# EAGLE design homeboard13 (EAGLE 6.0)
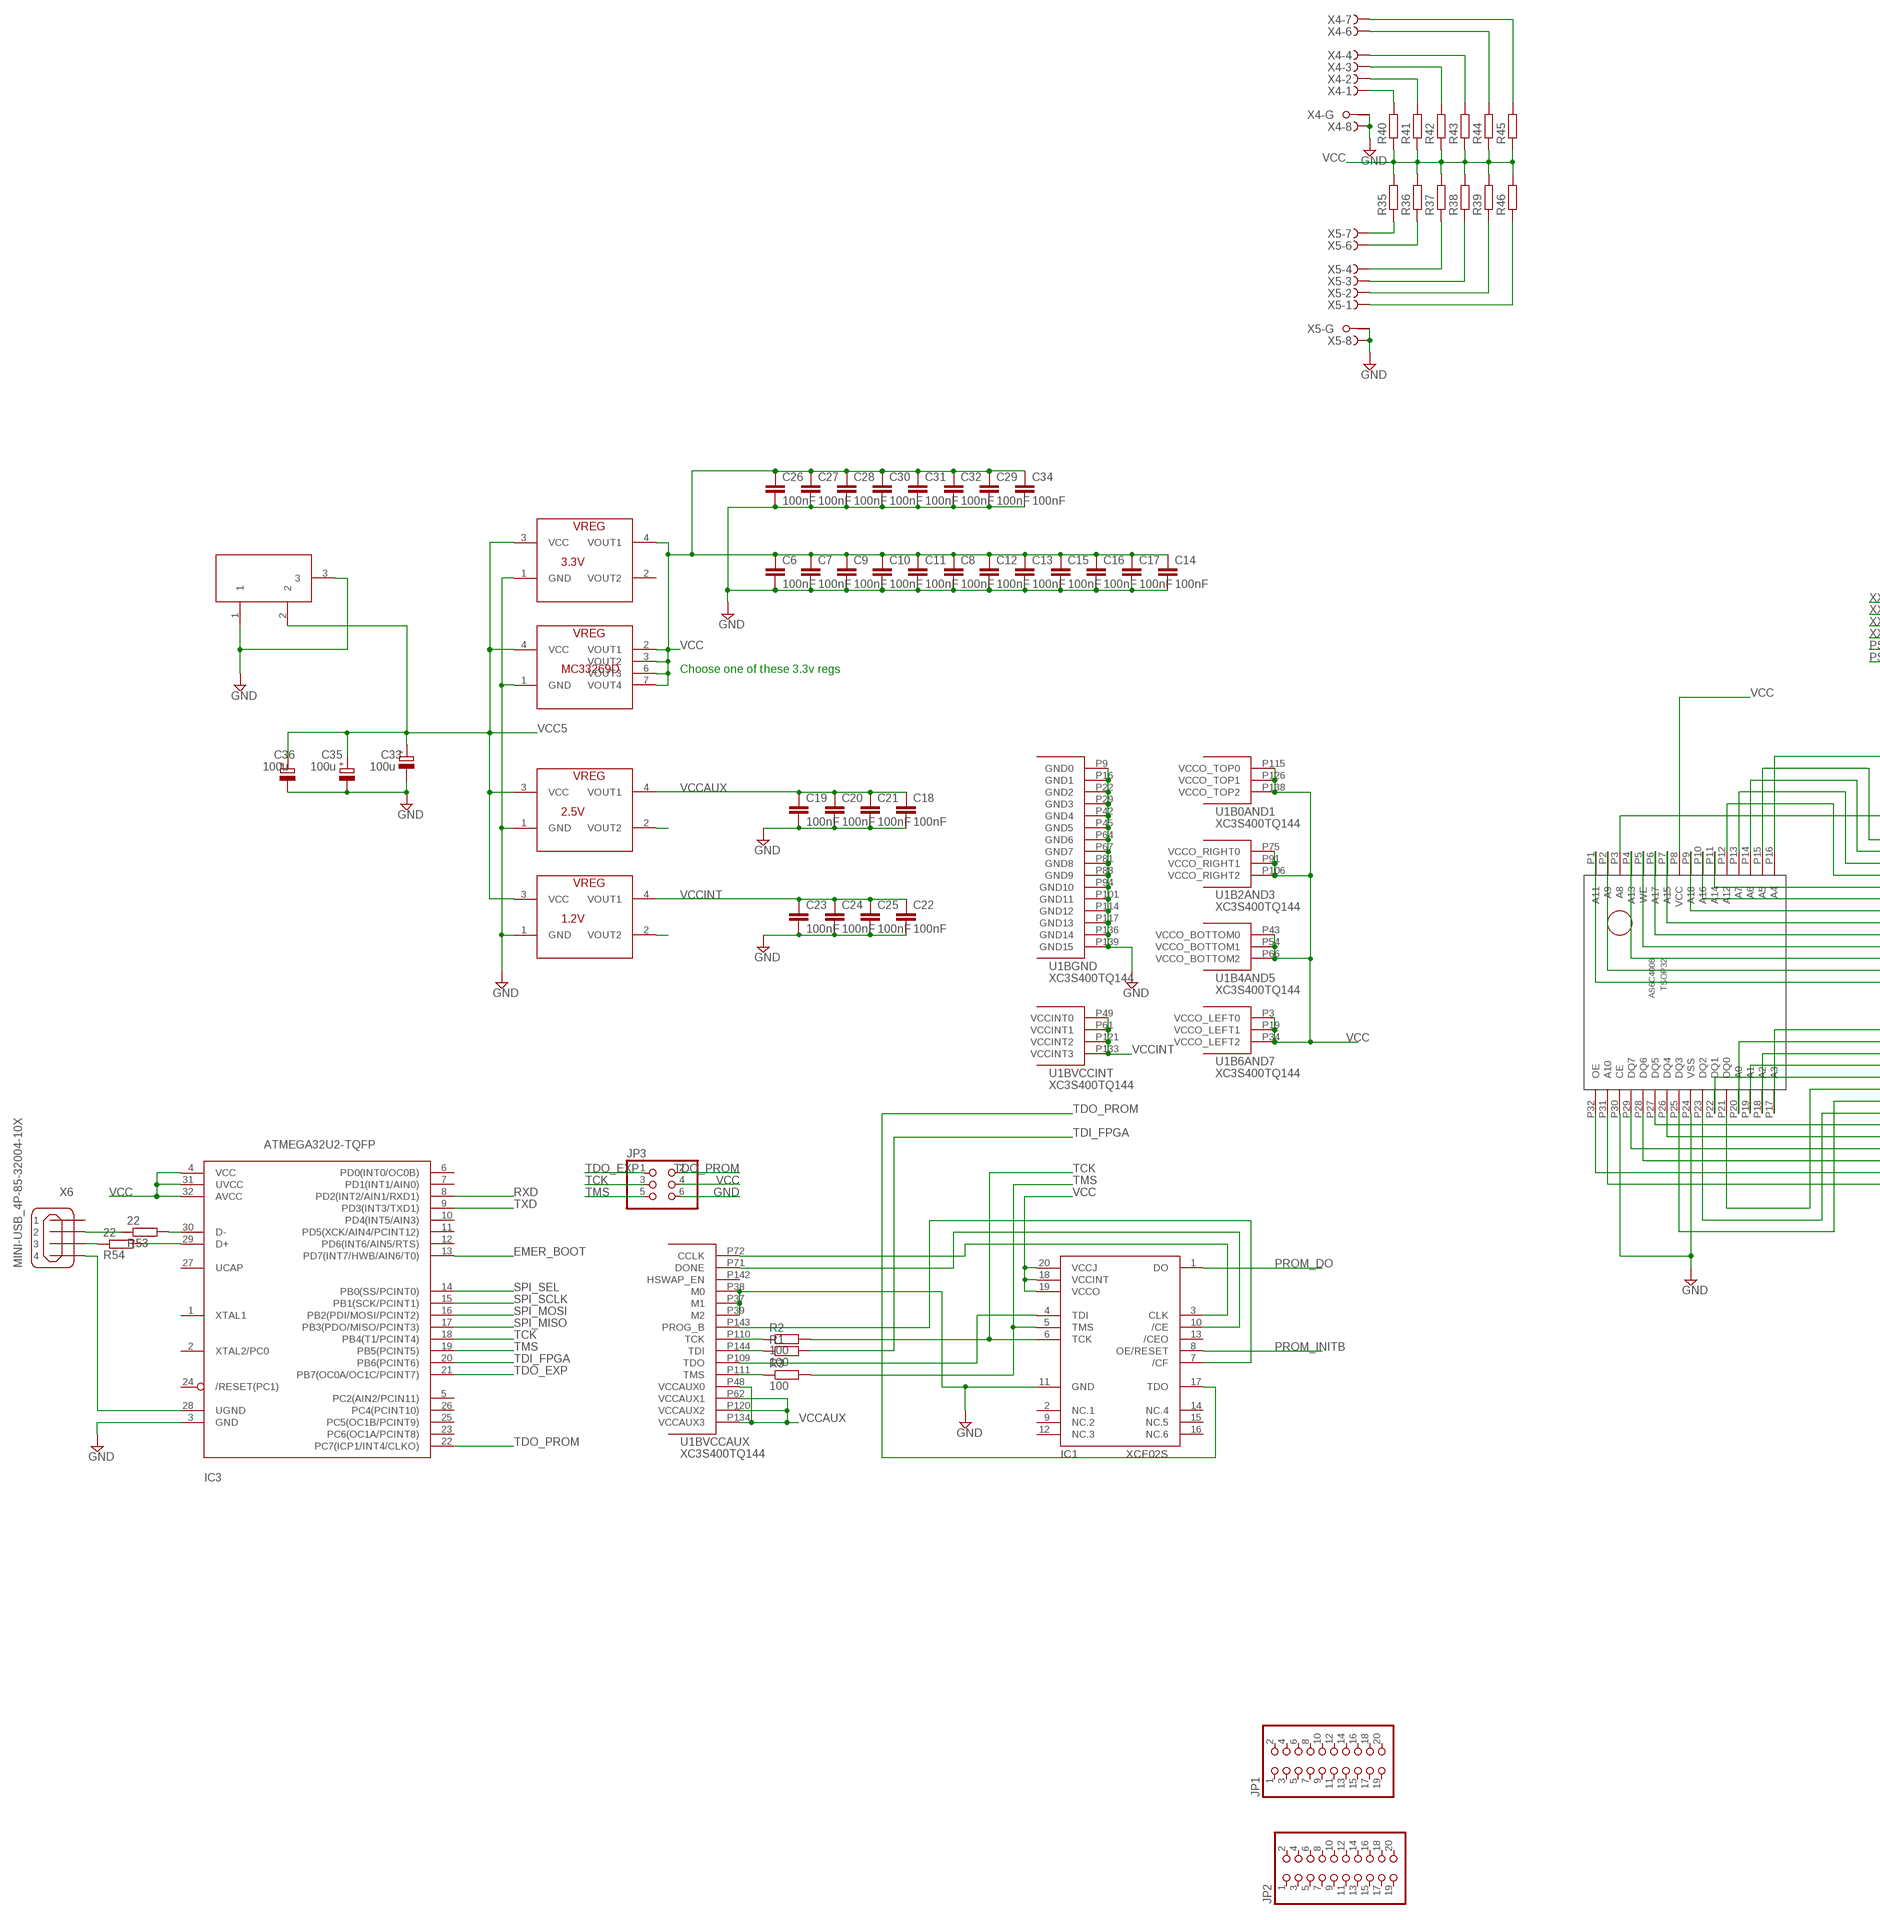
[diagram p0: schematic, sheet 1, part 1 of 3]
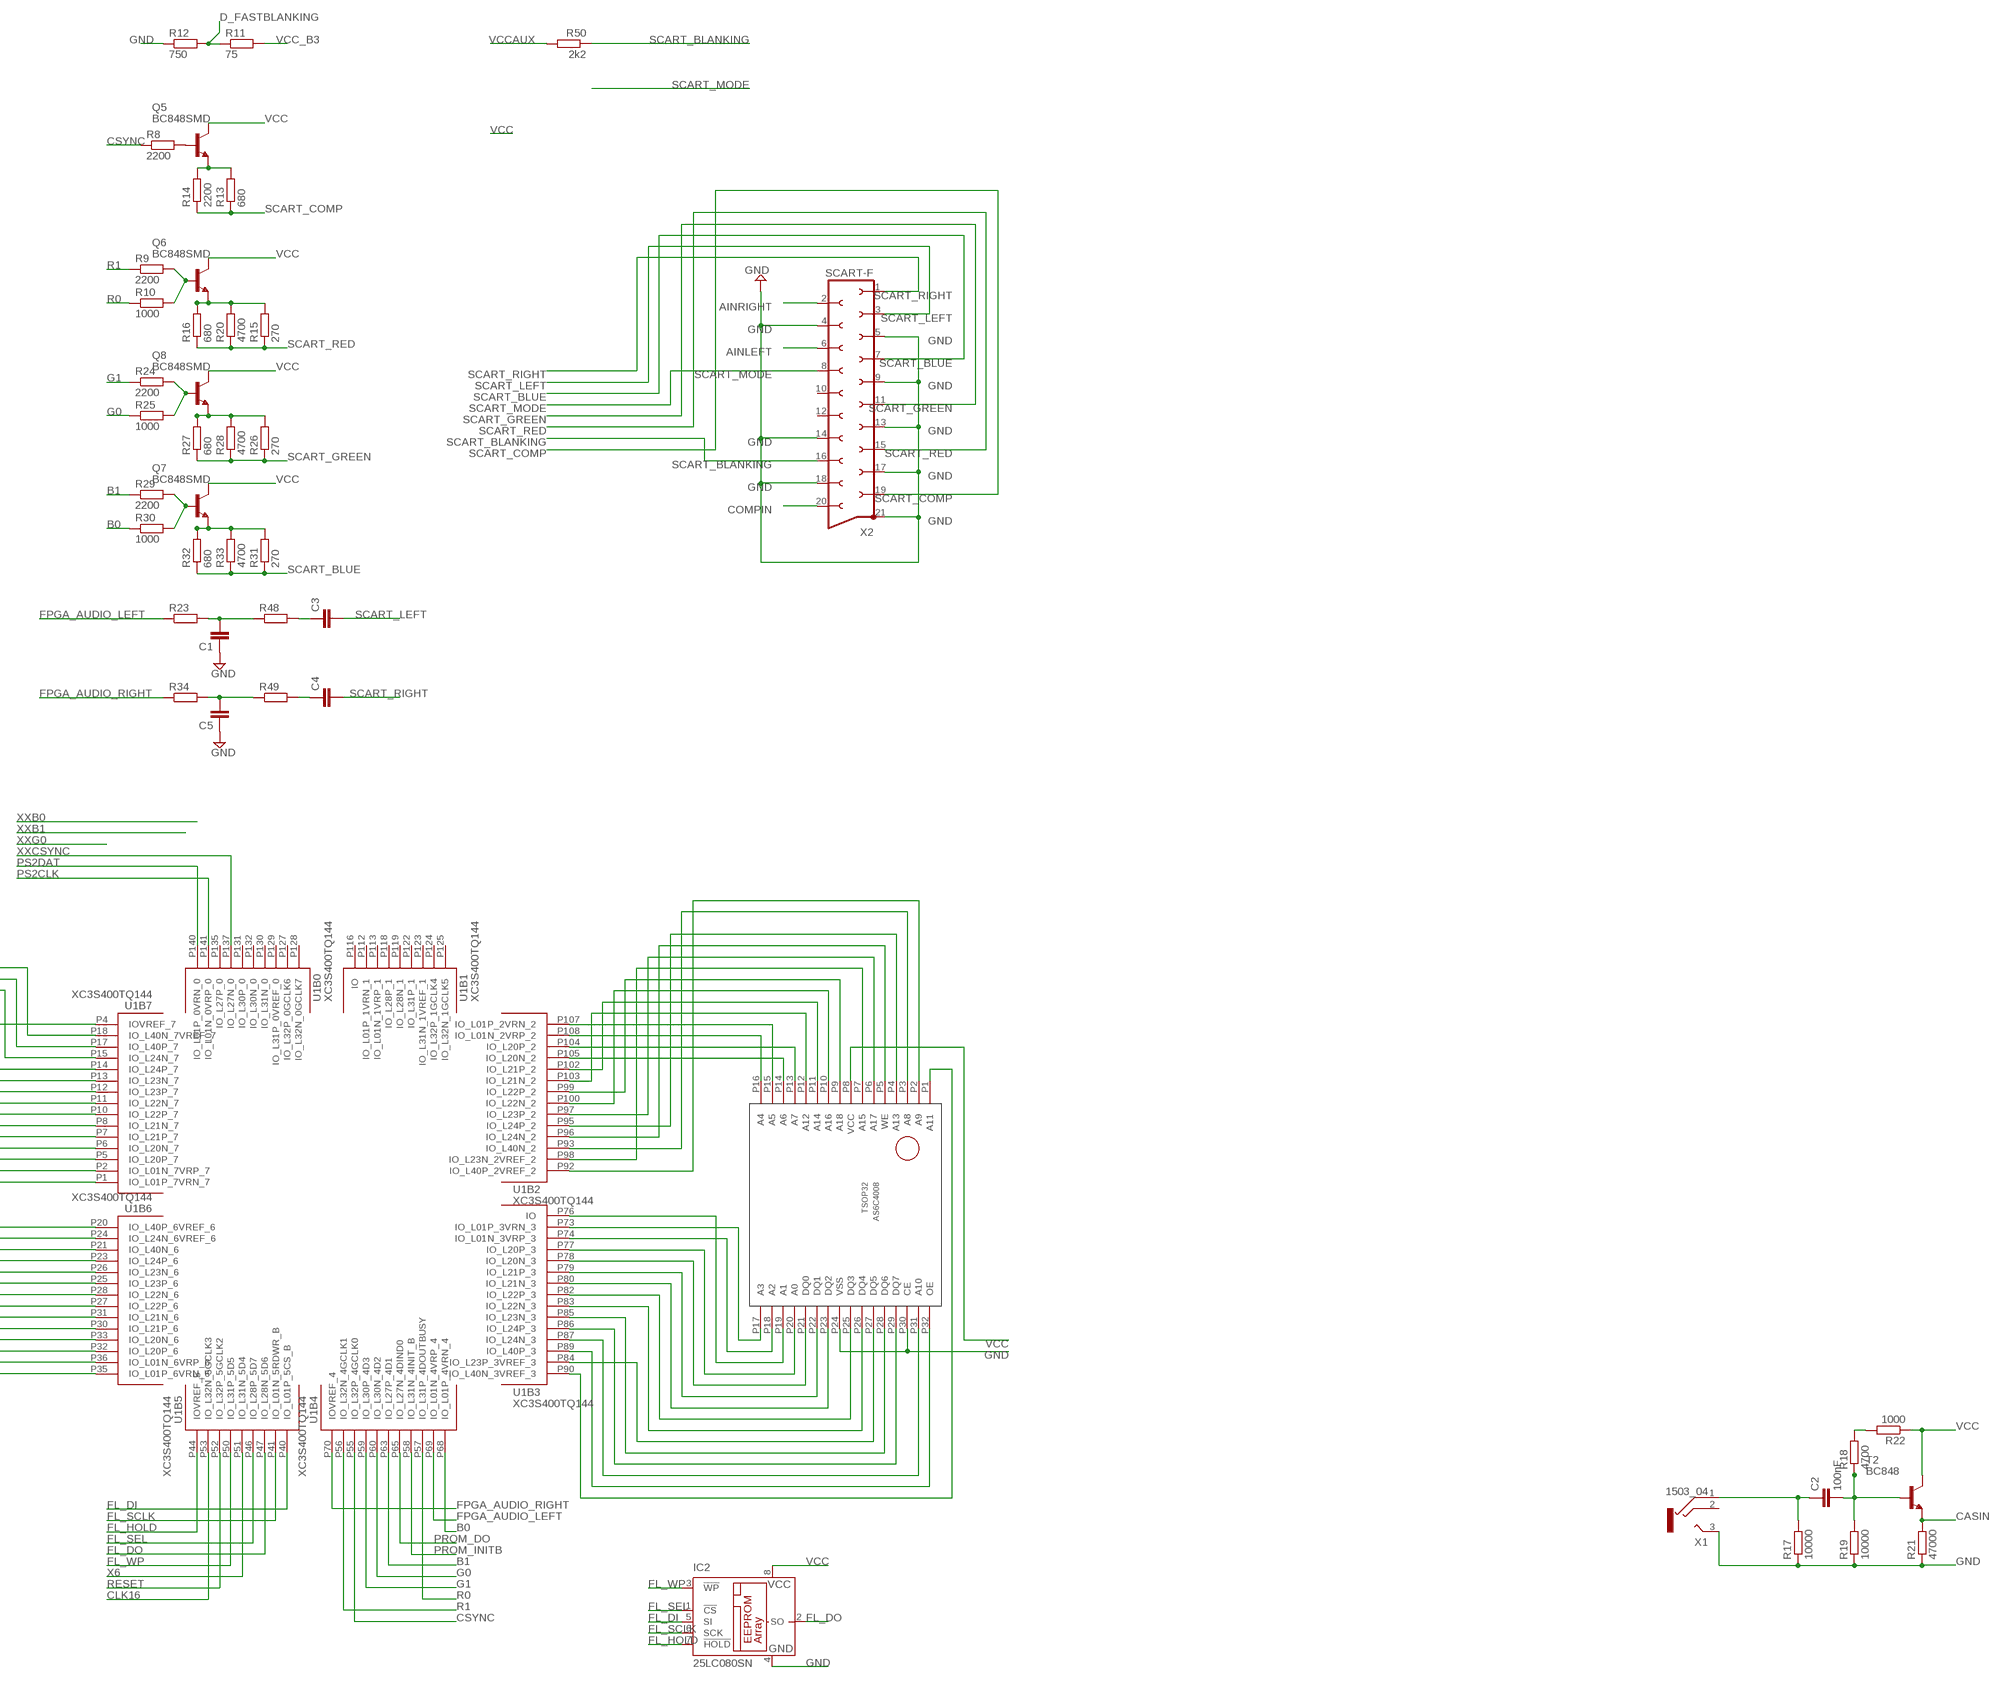
[diagram p1: schematic, sheet 1, part 2 of 3]
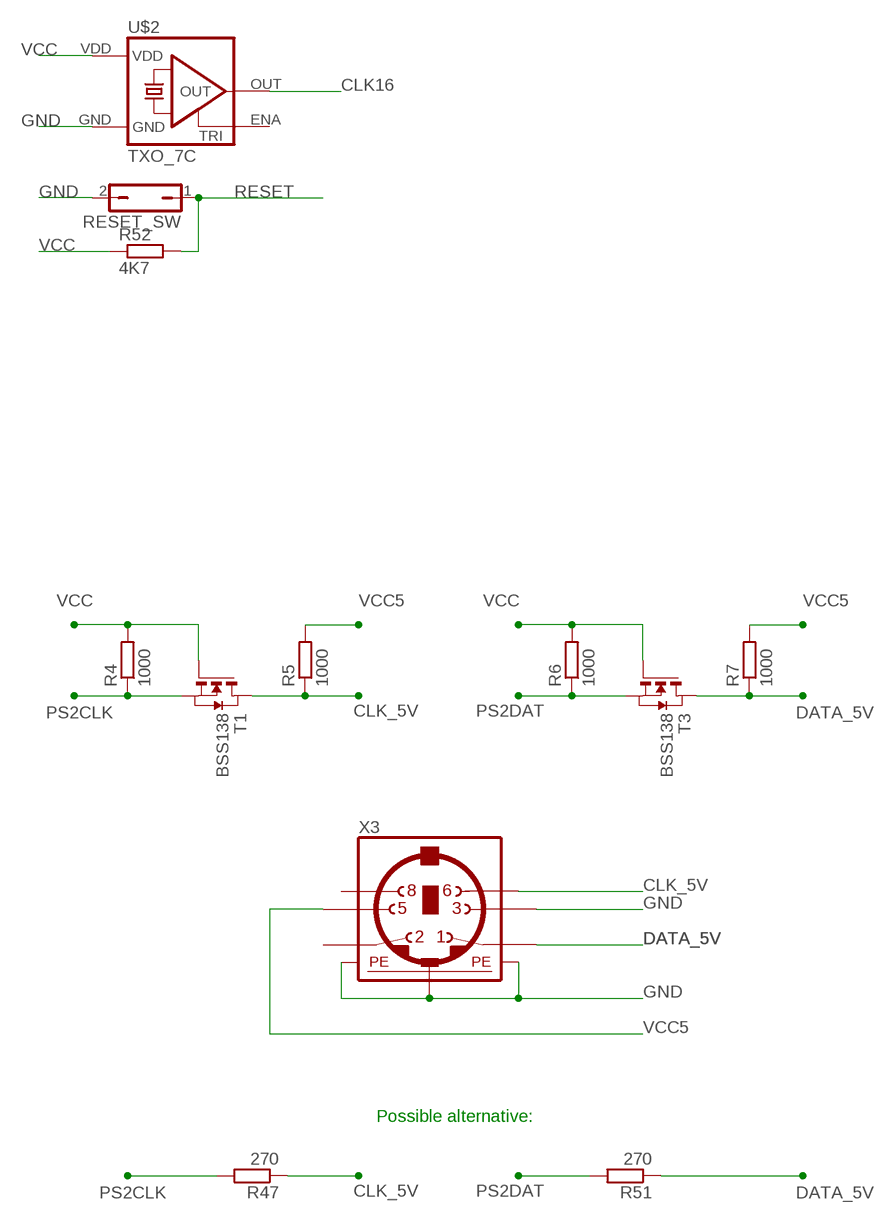
[diagram p2: schematic, sheet 1, part 3 of 3]

## Parts
C1  C-EUC0603  [C0603]
C2  100nF  C-EUC0603  [C0603]
C3  C-EUC0603  [C0603]
C4  C-EUC0603  [C0603]
C5  C-EUC0603  [C0603]
C6  100nF  C-EUC0603  [C0603]
C7  100nF  C-EUC0603  [C0603]
C8  100nF  C-EUC0603  [C0603]
C9  100nF  C-EUC0603  [C0603]
C10  100nF  C-EUC0603  [C0603]
C11  100nF  C-EUC0603  [C0603]
C12  100nF  C-EUC0603  [C0603]
C13  100nF  C-EUC0603  [C0603]
C14  100nF  C-EUC0603  [C0603]
C15  100nF  C-EUC0603  [C0603]
C16  100nF  C-EUC0603  [C0603]
C17  100nF  C-EUC0603  [C0603]
C18  100nF  C-EUC0603  [C0603]
C19  100nF  C-EUC0603  [C0603]
C20  100nF  C-EUC0603  [C0603]
C21  100nF  C-EUC0603  [C0603]
C22  100nF  C-EUC0603  [C0603]
C23  100nF  C-EUC0603  [C0603]
C24  100nF  C-EUC0603  [C0603]
C25  100nF  C-EUC0603  [C0603]
C26  100nF  C-EUC0603  [C0603]
C27  100nF  C-EUC0603  [C0603]
C28  100nF  C-EUC0603  [C0603]
C29  100nF  C-EUC0603  [C0603]
C30  100nF  C-EUC0603  [C0603]
C31  100nF  C-EUC0603  [C0603]
C32  100nF  C-EUC0603  [C0603]
C33  100u  CPOL-EUD  [PANASONIC_D]
C34  100nF  C-EUC0603  [C0603]
C35  100u  CPOL-EUD  [PANASONIC_D]
C36  100u  CPOL-EUD  [PANASONIC_D]
IC1  XCF02S  [VO20]
IC2  25LC080SN  [SO-08]
IC3  ATMEGA32U2-TQFP  [TQFP32-08]
JP1  PINHD-2X10  [2X10]
JP2  PINHD-2X10  [2X10]
JP3  PINHD-2X3  [2X03]
Q5  BC848SMD  [SOT23]
Q6  BC848SMD  [SOT23]
Q7  BC848SMD  [SOT23]
Q8  BC848SMD  [SOT23]
R1  100  R-EU_R0805  [R0805]
R2  100  R-EU_R0805  [R0805]
R3  100  R-EU_R0805  [R0805]
R4  1000  R-EU_R0805  [R0805]
R5  1000  R-EU_R0805  [R0805]
R6  1000  R-EU_R0805  [R0805]
R7  1000  R-EU_R0805  [R0805]
R8  2200  R-EU_R0805  [R0805]
R9  2200  R-EU_R0805  [R0805]
R10  1000  R-EU_R0805  [R0805]
R11  75  R-EU_R0805  [R0805]
R12  750  R-EU_R0805  [R0805]
R13  680  R-EU_R0805  [R0805]
R14  2200  R-EU_R0805  [R0805]
R15  270  R-EU_R0805  [R0805]
R16  680  R-EU_R0805  [R0805]
R17  10000  R-EU_R0805  [R0805]
R18  4700  R-EU_R0805  [R0805]
R19  10000  R-EU_R0805  [R0805]
R20  4700  R-EU_R0805  [R0805]
R21  47000  R-EU_R0805  [R0805]
R22  1000  R-EU_R0805  [R0805]
R23  R-EU_M0805  [M0805]
R24  2200  R-EU_R0805  [R0805]
R25  1000  R-EU_R0805  [R0805]
R26  270  R-EU_R0805  [R0805]
R27  680  R-EU_R0805  [R0805]
R28  4700  R-EU_R0805  [R0805]
R29  2200  R-EU_R0805  [R0805]
R30  1000  R-EU_R0805  [R0805]
R31  270  R-EU_R0805  [R0805]
R32  680  R-EU_R0805  [R0805]
R33  4700  R-EU_R0805  [R0805]
R34  R-EU_M0805  [M0805]
R35  R-EU_M0805  [M0805]
R36  R-EU_M0805  [M0805]
R37  R-EU_M0805  [M0805]
R38  R-EU_M0805  [M0805]
R39  R-EU_M0805  [M0805]
R40  R-EU_M0805  [M0805]
R41  R-EU_M0805  [M0805]
R42  R-EU_M0805  [M0805]
R43  R-EU_M0805  [M0805]
R44  R-EU_M0805  [M0805]
R45  R-EU_M0805  [M0805]
R46  R-EU_M0805  [M0805]
R47  270  R-EU_R0805  [R0805]
R48  R-EU_M0805  [M0805]
R49  R-EU_M0805  [M0805]
R50  2k2  R-EU_M0805  [M0805]
R51  270  R-EU_R0805  [R0805]
R52  4K7  R-EU_M0805  [M0805]
R53  22  R-EU_R0805  [R0805]
R54  22  R-EU_R0805  [R0805]
REG1.2  1.2V  NX1117  [SOT223]
REG2.5  2.5V  NX1117  [SOT223]
RESET_SW  JP1Q  [JP1]
T1  BSS138  NMOSSOT23  [SOT-23]
T2  BC848  [SOT23]
T3  BSS138  NMOSSOT23  [SOT-23]
U1  XC3S400TQ144  [TQ144]
U$1  AS6C4008  [TSOP32]
U$2  TXO_7C  [OSC_7C]
U$4  3.3V  NX1117  [SOT223]
U$5  MC33269D  [SO8]
U$6  AS6C4008  [TSOP32]
X1  1503_04  [1503_04]
X2  SCART-F  [SCART-F]
X3  MINI_DIN_6  [M_DIN6]
X4  F09HPS  [F09HP]
X5  F09HPS  [F09HP]
X6  MINI-USB_4P-85-32004-10X  [85-32004-10X]
X8  DC21MMX  [DC-21MM]

## Nets
AINLEFT: X2.6
AINRIGHT: X2.2
B0: R30.1 U1.P68(B4:IO_L01P_4VRN_4)
B1: R29.1 U1.P63(B4:IO_L27P_4D1)
CASIN: R21.2 T2.2(E)
CLK16: U1.P53(B5:IO_L32N_5GCLK3) U$2.OUT
CLK_5V: R5.1 R47.1 T1.1(D) X3.6
COMPIN: X2.20
CSYNC: R8.1 U1.P55(B4:IO_L32P_4GCLK0)
D_FASTBLANKING: R11.1 R12.2
DATA_5V: R7.1 R51.1 T3.1(D) X3.1
EMER_BOOT: IC3.13(PD7(INT7/HWB/AIN6/T0))
FL_DI: IC2.5(SI) U1.P40(B5:IO_L01P_5CS_B)
FL_DO: IC2.2(SO) U1.P47(B5:IO_L28N_5D6)
FL_HOLD: IC2.7(!HOLD) U1.P44(B5:IOVREF_5)
FL_SCLK: IC2.6(SCK) U1.P41(B5:IO_L01N_5RDWR_B)
FL_SEL: IC2.1(!CS) U1.P46(B5:IO_L28P_5D7)
FL_WP: IC2.3(!WP) U1.P50(B5:IO_L31P_5D5)
FPGA_AUDIO_LEFT: R23.1 U1.P69(B4:IO_L01N_4VRP_4)
FPGA_AUDIO_RIGHT: R34.1 U1.P70(B4:IOVREF_4)
G0: R25.1 U1.P60(B4:IO_L30N_4D2)
G1: R24.1 U1.P59(B4:IO_L30P_4D3)
GND: C1.1 C5.1 C6.2 C7.2 C8.2 C9.2 C10.2 C11.2 C12.2 C13.2 C14.2 C15.2 C16.2 C17.2 C18.2 C19.2 C20.2 C21.2 C22.2 C23.2 C24.2 C25.2 C26.2 C27.2 C28.2 C29.2 C30.2 C31.2 C32.2 C33.- C34.2 C35.- C36.- IC1.11(GND) IC2.4(GND) IC3.3(GND) JP3.6 R12.1 R17.1 R19.1 R21.1 REG1.2.1(GND) REG2.5.1(GND) RESET_SW.2 U1.P9(BGND:GND0) U1.P16(BGND:GND1) U1.P22(BGND:GND2) U1.P29(BGND:GND3) U1.P37(BVCCAUX:M1) U1.P38(BVCCAUX:M0) U1.P39(BVCCAUX:M2) U1.P42(BGND:GND4) U1.P45(BGND:GND5) U1.P64(BGND:GND6) U1.P67(BGND:GND7) U1.P81(BGND:GND8) U1.P88(BGND:GND9) U1.P94(BGND:GND10) U1.P101(BGND:GND11) U1.P114(BGND:GND12) U1.P117(BGND:GND13) U1.P136(BGND:GND14) U1.P139(BGND:GND15) U$1.P24(VSS) U$1.P30(CE) U$2.GND U$4.1(GND) U$5.1(GND) U$6.P24(VSS) U$6.P30(CE) X1.3 X2.4 X2.5 X2.9 X2.13 X2.14 X2.17 X2.18 X2.21 X3.3 X3.SH1(PE1) X3.SH2(PE2) X3.SH3(PE3) X4.8(-8:F) X4.G1(-G:G1) X5.8(-8:F) X5.G1(-G:G1) X8.1 X8.3
N$1: U1.P108(B2:IO_L01N_2VRP_2) U$1.P16(A4)
N$2: U1.P107(B2:IO_L01P_2VRN_2) U$1.P15(A5)
N$3: U1.P105(B2:IO_L20N_2) U$1.P14(A6)
N$4: U1.P104(B2:IO_L20P_2) U$1.P13(A7)
N$5: U1.P103(B2:IO_L21N_2) U$1.P12(A12)
N$6: U1.P102(B2:IO_L21P_2) U$1.P11(A14)
N$7: U1.P100(B2:IO_L22N_2) U$1.P10(A16)
N$8: U1.P99(B2:IO_L22P_2) U$1.P9(A18)
N$9: U1.P98(B2:IO_L23N_2VREF_2) U$1.P7(A15)
N$10: U1.P97(B2:IO_L23P_2) U$1.P6(A17)
N$11: U1.P96(B2:IO_L24N_2) U$1.P5(WE)
N$12: U1.P95(B2:IO_L24P_2) U$1.P4(A13)
N$13: U1.P93(B2:IO_L40N_2) U$1.P3(A8)
N$14: U1.P92(B2:IO_L40P_2VREF_2) U$1.P2(A9)
N$15: U1.P90(B3:IO_L40N_3VREF_3) U$1.P1(A11)
N$16: U1.P73(B3:IO_L01P_3VRN_3) U$1.P17(A3)
N$17: U1.P74(B3:IO_L01N_3VRP_3) U$1.P18(A2)
N$18: U1.P76(B3:IO) U$1.P19(A1)
N$19: U1.P77(B3:IO_L20P_3) U$1.P20(A0)
N$20: U1.P78(B3:IO_L20N_3) U$1.P21(DQ0)
N$21: U1.P79(B3:IO_L21P_3) U$1.P22(DQ1)
N$22: U1.P80(B3:IO_L21N_3) U$1.P23(DQ2)
N$23: U1.P82(B3:IO_L22P_3) U$1.P25(DQ3)
N$24: U1.P83(B3:IO_L22N_3) U$1.P26(DQ4)
N$25: U1.P84(B3:IO_L23P_3VREF_3) U$1.P27(DQ5)
N$26: U1.P85(B3:IO_L23N_3) U$1.P28(DQ6)
N$27: U1.P86(B3:IO_L24P_3) U$1.P29(DQ7)
N$28: U1.P87(B3:IO_L24N_3) U$1.P31(A10)
N$29: U1.P89(B3:IO_L40P_3) U$1.P32(OE)
N$30: R35.1 X5.7(-7:F)
N$31: R36.1 X5.6(-6:F)
N$32: R37.1 X5.4(-4:F)
N$33: R38.1 X5.3(-3:F)
N$34: R39.1 X5.2(-2:F)
N$35: IC1.3(CLK) U1.P72(BVCCAUX:CCLK)
N$36: R53.1 X6.2
N$37: R46.1 X5.1(-1:F)
N$38: IC1.10(/CE) U1.P71(BVCCAUX:DONE)
N$39: R2.1 U1.P110(BVCCAUX:TCK)
N$40: IC1.7(/CF) U1.P143(BVCCAUX:PROG_B)
N$41: R40.2 X4.1(-1:F)
N$42: R1.1 U1.P144(BVCCAUX:TDI)
N$43: R3.1 U1.P111(BVCCAUX:TMS)
N$44: R41.2 X4.2(-2:F)
N$45: R42.2 X4.3(-3:F)
N$46: R43.2 X4.4(-4:F)
N$47: R44.2 X4.6(-6:F)
N$48: R45.2 X4.7(-7:F)
N$49: IC3.29(D+) R54.2
N$50: REG2.5.2(VOUT2)
N$51: C1.2 R23.2 R48.1
N$52: C3.1 R48.2
N$53: Q6.1(B) R9.2 R10.2
N$54: Q6.2(E) R15.2 R16.2 R20.2
N$55: Q8.1(B) R24.2 R25.2
N$56: Q8.2(E) R26.2 R27.2 R28.2
N$57: Q7.1(B) R29.2 R30.2
N$58: Q7.2(E) R31.2 R32.2 R33.2
N$59: Q5.2(E) R13.2 R14.2
N$60: C2.2 R18.1 R19.2 T2.1(B)
N$61: C2.1 R17.2 X1.1
N$62: R18.2 R22.2
N$63: Q5.1(B) R8.2
N$64: C4.1 R49.2
N$65: C5.2 R34.2 R49.1
N$66: R54.1 X6.3
N$67: U1.P1(B7:IO_L01P_7VRN_7) U$6.P1(A11)
N$68: IC3.30(D-) R53.2
N$69: IC3.28(UGND) X6.4
N$70: REG1.2.2(VOUT2)
N$71: U1.P2(B7:IO_L01N_7VRP_7) U$6.P2(A9)
N$72: U1.P4(B7:IOVREF_7) U$6.P3(A8)
N$73: U1.P5(B7:IO_L20P_7) U$6.P4(A13)
N$74: U1.P6(B7:IO_L20N_7) U$6.P5(WE)
N$75: U1.P7(B7:IO_L21P_7) U$6.P6(A17)
N$76: U1.P8(B7:IO_L21N_7) U$6.P7(A15)
N$77: U1.P10(B7:IO_L22P_7) U$6.P9(A18)
N$78: U1.P11(B7:IO_L22N_7) U$6.P10(A16)
N$79: U1.P12(B7:IO_L23P_7) U$6.P11(A14)
N$80: U1.P13(B7:IO_L23N_7) U$6.P12(A12)
N$81: U1.P14(B7:IO_L24P_7) U$6.P13(A7)
N$82: U1.P15(B7:IO_L24N_7) U$6.P14(A6)
N$83: U1.P17(B7:IO_L40P_7) U$6.P15(A5)
N$84: U1.P18(B7:IO_L40N_7VREF_7) U$6.P16(A4)
N$85: U1.P20(B6:IO_L40P_6VREF_6) U$6.P17(A3)
N$86: U1.P21(B6:IO_L40N_6) U$6.P18(A2)
N$87: U1.P23(B6:IO_L24P_6) U$6.P19(A1)
N$88: U1.P24(B6:IO_L24N_6VREF_6) U$6.P20(A0)
N$89: U1.P25(B6:IO_L23P_6) U$6.P21(DQ0)
N$90: U1.P26(B6:IO_L23N_6) U$6.P22(DQ1)
N$91: U1.P27(B6:IO_L22P_6) U$6.P23(DQ2)
N$92: U1.P28(B6:IO_L22N_6) U$6.P25(DQ3)
N$93: U1.P30(B6:IO_L21P_6) U$6.P26(DQ4)
N$94: U1.P31(B6:IO_L21N_6) U$6.P27(DQ5)
N$95: U1.P32(B6:IO_L20P_6) U$6.P28(DQ6)
N$96: U1.P33(B6:IO_L20N_6) U$6.P29(DQ7)
N$97: U1.P35(B6:IO_L01P_6VRN_6) U$6.P31(A10)
N$98: U1.P36(B6:IO_L01N_6VRP_6) U$6.P32(OE)
PROM_DO: IC1.1(DO) U1.P65(B4:IO_L27N_4DIND0)
PROM_INITB: IC1.8(OE/RESET) U1.P58(B4:IO_L31N_4INIT_B)
PS2CLK: R4.1 R47.2 T1.2(S) U1.P141(B0:IO_L01N_0VRP_0)
PS2DAT: R6.1 R51.2 T3.2(S) U1.P140(B0:IO_L01P_0VRN_0)
R0: R10.1 U1.P57(B4:IO_L31P_4DOUTBUSY)
R1: R9.1 U1.P56(B4:IO_L32N_4GCLK1)
RESET: R52.2 RESET_SW.1 U1.P52(B5:IO_L32P_5GCLK2)
RXD: IC3.8(PD2(INT2/AIN1/RXD1))
SCART_BLANKING: R50.1 X2.16
SCART_BLUE: R31.1 R32.1 R33.1 X2.7
SCART_COMP: R13.1 R14.1 X2.19
SCART_GREEN: R26.1 R27.1 R28.1 X2.11
SCART_LEFT: C3.2 X2.3
SCART_MODE: X2.8
SCART_RED: R15.1 R16.1 R20.1 X2.15
SCART_RIGHT: C4.2 X2.1
SPI_MISO: IC3.17(PB3(PDO/MISO/PCINT3))
SPI_MOSI: IC3.16(PB2(PDI/MOSI/PCINT2))
SPI_SCLK: IC3.15(PB1(SCK/PCINT1))
SPI_SEL: IC3.14(PB0(SS/PCINT0))
TCK: IC1.6(TCK) IC3.18(PB4(T1/PCINT4)) JP3.3 R2.2
TDI_FPGA: IC3.20(PB6(PCINT6)) R1.2
TDO_EXP: IC3.21(PB7(OC0A/OC1C/PCINT7)) JP3.1
TDO_FPGA: IC1.4(TDI) U1.P109(BVCCAUX:TDO)
TDO_PROM: IC1.17(TDO) IC3.22(PC7(ICP1/INT4/CLKO)) JP3.2
TMS: IC1.5(TMS) IC3.19(PB5(PCINT5)) JP3.5 R3.2
TXD: IC3.9(PD3(INT3/TXD1))
VCC: C6.1 C7.1 C8.1 C9.1 C10.1 C11.1 C12.1 C13.1 C14.1 C15.1 C16.1 C17.1 C26.1 C27.1 C28.1 C29.1 C30.1 C31.1 C32.1 C34.1 IC1.18(VCCINT) IC1.19(VCCO) IC1.20(VCCJ) IC2.8(VCC) IC3.4(VCC) IC3.31(UVCC) IC3.32(AVCC) JP3.4 Q5.3(C) Q6.3(C) Q7.3(C) Q8.3(C) R4.2 R6.2 R22.1 R35.2 R36.2 R37.2 R38.2 R39.2 R40.1 R41.1 R42.1 R43.1 R44.1 R45.1 R46.2 R52.1 T1.3(G) T2.3(C) T3.3(G) U1.P3(B6AND7:VCCO_LEFT0) U1.P19(B6AND7:VCCO_LEFT1) U1.P34(B6AND7:VCCO_LEFT2) U1.P43(B4AND5:VCCO_BOTTOM0) U1.P54(B4AND5:VCCO_BOTTOM1) U1.P66(B4AND5:VCCO_BOTTOM2) U1.P75(B2AND3:VCCO_RIGHT0) U1.P91(B2AND3:VCCO_RIGHT1) U1.P106(B2AND3:VCCO_RIGHT2) U1.P115(B0AND1:VCCO_TOP0) U1.P126(B0AND1:VCCO_TOP1) U1.P138(B0AND1:VCCO_TOP2) U$1.P8(VCC) U$2.VDD U$4.4(VOUT1) U$5.2(VOUT1) U$5.3(VOUT2) U$5.6(VOUT3) U$5.7(VOUT4) U$6.P8(VCC)
VCC5: C33.+ C35.+ C36.+ R5.2 R7.2 REG1.2.3(VCC) REG2.5.3(VCC) U$4.3(VCC) U$5.4(VCC) X3.5 X8.2
VCC_B3: R11.2
VCCAUX: C18.1 C19.1 C20.1 C21.1 R50.2 REG2.5.4(VOUT1) U1.P48(BVCCAUX:VCCAUX0) U1.P62(BVCCAUX:VCCAUX1) U1.P120(BVCCAUX:VCCAUX2) U1.P134(BVCCAUX:VCCAUX3)
VCCINT: C22.1 C23.1 C24.1 C25.1 REG1.2.4(VOUT1) U1.P49(BVCCINT:VCCINT0) U1.P61(BVCCINT:VCCINT1) U1.P121(BVCCINT:VCCINT2) U1.P133(BVCCINT:VCCINT3)
X6: U1.P51(B5:IO_L31N_5D4)
XXCSYNC: U1.P137(B0:IO_L27N_0)
Unconnected: IC1.2(NC.1) IC1.9(NC.2) IC1.12(NC.3) IC1.13(/CEO) IC1.14(NC.4) IC1.15(NC.5) IC1.16(NC.6) IC3.1(XTAL1) IC3.2(XTAL2/PC0) IC3.5(PC2(AIN2/PCIN11)) IC3.6(PD0(INT0/OC0B)) IC3.7(PD1(INT1/AIN0)) IC3.10(PD4(INT5/AIN3)) IC3.11(PD5(XCK/AIN4/PCINT12)) IC3.12(PD6(INT6/AIN5/RTS)) IC3.23(PC6(OC1A/PCINT8)) IC3.24(/RESET(PC1)) IC3.25(PC5(OC1B/PCINT9)) IC3.26(PC4(PCINT10)) IC3.27(UCAP) JP1.1 JP1.2 JP1.3 JP1.4 JP1.5 JP1.6 JP1.7 JP1.8 JP1.9 JP1.10 JP1.11 JP1.12 JP1.13 JP1.14 JP1.15 JP1.16 JP1.17 JP1.18 JP1.19 JP1.20 JP2.1 JP2.2 JP2.3 JP2.4 JP2.5 JP2.6 JP2.7 JP2.8 JP2.9 JP2.10 JP2.11 JP2.12 JP2.13 JP2.14 JP2.15 JP2.16 JP2.17 JP2.18 JP2.19 JP2.20 U1.P112(B1:IO_L01P_1VRN_1) U1.P113(B1:IO_L01N_1VRP_1) U1.P116(B1:IO) U1.P118(B1:IO_L28P_1) U1.P119(B1:IO_L28N_1) U1.P122(B1:IO_L31P_1) U1.P123(B1:IO_L31N_1VREF_1) U1.P124(B1:IO_L32P_1GCLK4) U1.P125(B1:IO_L32N_1GCLK5) U1.P127(B0:IO_L32P_0GCLK6) U1.P128(B0:IO_L32N_0GCLK7) U1.P129(B0:IO_L31P_0VREF_0) U1.P130(B0:IO_L31N_0) U1.P131(B0:IO_L30P_0) U1.P132(B0:IO_L30N_0) U1.P135(B0:IO_L27P_0) U1.P142(BVCCAUX:HSWAP_EN) U$2.ENA(TRI) U$4.2(VOUT2) X1.2 X2.10 X2.12 X3.2 X3.8 X4.5(-5:F) X4.9(-9:F) X4.G2(-G:G2) X5.5(-5:F) X5.9(-9:F) X5.G2(-G:G2) X6.1

## Notes on the sheet
- Choose one of these 3.3v regs
- Possible alternative:

## Library data of the parts
C1-C5 = resistor:C-EU: CAPACITOR, European symbol
C6-C32 C34 = rcl:C-EU: CAPACITOR, European symbol
C33 C35 C36 = rcl:CPOL-EU: POLARIZED CAPACITOR, European symbol
IC1 = smd-special:XCF02S
IC2 = microchip:25*: Serial EEPROM 4K/ 8K , SPI bus; MF: MICROCHIP; MPN: 25LC080/SN; OC_FARNELL: 1137302; OC_NEWARK: 96K4092
IC3 = adafruit:ATMEGA32U2: ATmega32u2 Pin compatible with the atmega8u2, atmega16u2 and atmega32u2 8, 16 or 32 K flash, 1K RAM, 512b EEPROM 8 bit and 16 bit timer (5 PWM total) UART, SPI (no I2C!) USB with 4 endpoints, LUFA compatible 22 I/O lines, analog comparator (no ADC!) Comes with DFU bootloader burned in!
JP1 JP2 = pinhead:PINHD-2X10: PIN HEADER
JP3 = pinhead:PINHD-2X3: PIN HEADER
Q5-Q8 = bc548:BC848*: NPN Transistor
R1-R22 R24-R33 R47 R51 R53 R54 = rcl:R-EU_: RESISTOR, European symbol
R23 R34-R46 R48-R50 R52 = resistor:R-EU_: RESISTOR, European symbol
REG1.2 REG2.5 U$4 = cpcfpga:NX1117
RESET_SW = jumper:JP1Q: JUMPER
T1 T3 = zetex:NMOSSOT23: MOS FET; OC_FARNELL: unknown; OC_NEWARK: unknown
T2 = transistor:BC848: NPN TRANSISTOR
U1 = xilinx_spartan3_virtex4_and_5:XC3S400TQ144: Xilinx FPGA
U$1 U$6 = cpcfpga:AS6C4008
U$2 = cpcfpga:TXO_7C: TXC crystal oscillator http://www.txccrystal.com/images/pdf/7c.pdf
U$5 = cpcfpga:MC33269D
X1 = con-lumberg:1503_04: Jack connectors according to JISC 6560, 3.5 mm, IP 57 Klinkensteckverbinder nach JISC 6560, 3,5 mm, IP 57 Source: http://www.lumberg.com/Produkte/PDFs/1503_04.pdf; OC_FARNELL: 1216981; OC_NEWARK: unknown
X2 = con-hirschmann:SCART-F: TV SCART CONNECTOR; OC_FARNELL: unknown; OC_NEWARK: unknown
X3 = mini_din:MINI_DIN_6
X4 X5 = con-subd:F09HPS: SUB-D; OC_FARNELL: unknown; OC_NEWARK: unknown
X6 = con-cypressindustries:MINI-USB_4P-: MINI USB 4 Pol. Source: www.cypressindustries.com; OC_FARNELL: unknown; OC_NEWARK: unknown
X8 = powersupply:DC21MM

## Net classes
1 power: width 0.6 mm, drill 1.1 mm, clearance 0.4 mm
2 gnd: width 0.305 mm, drill 0.508 mm, clearance 0.152 mm

## Board
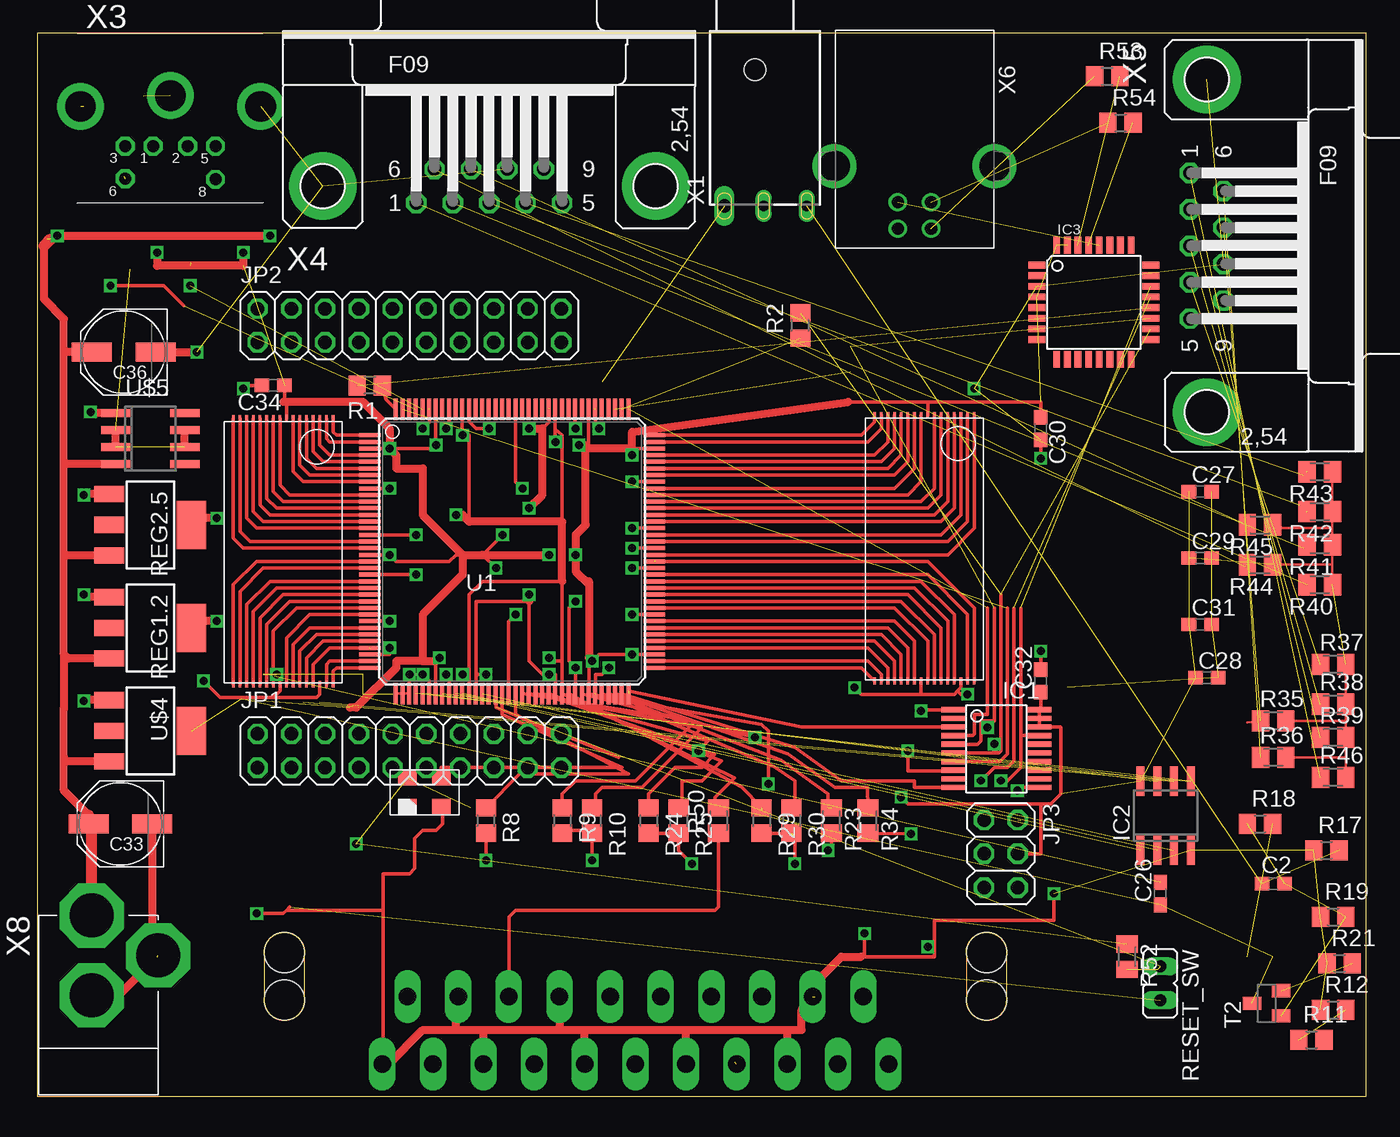
[diagram p3: board, top side]
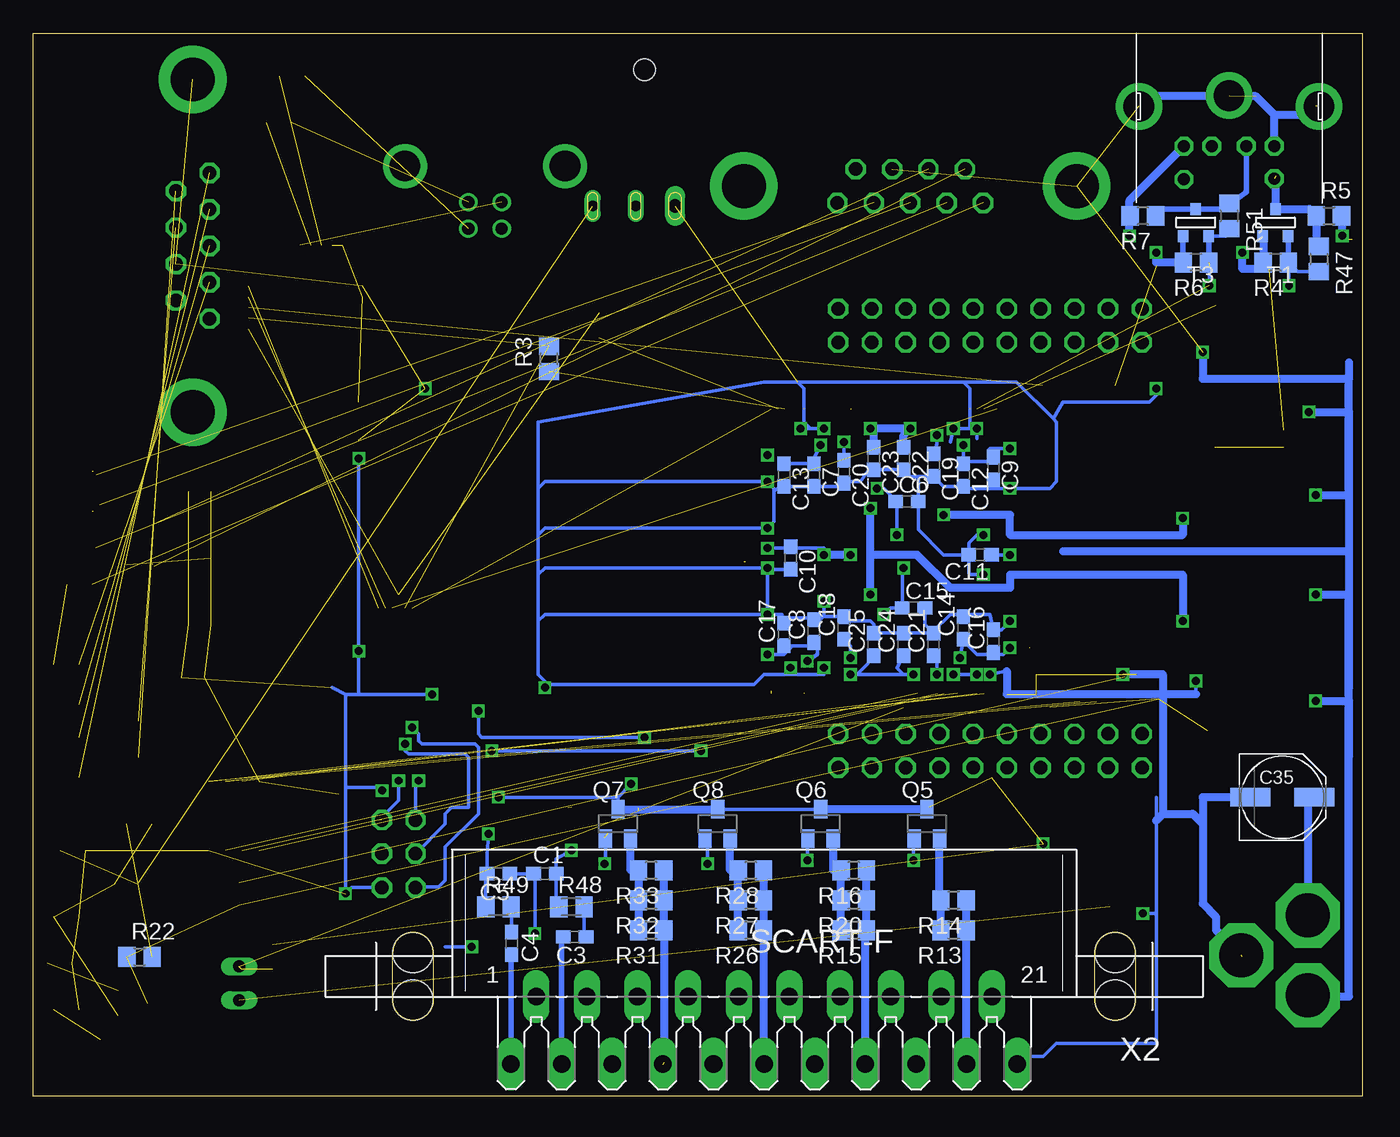
[diagram p4: board, bottom side, seen from below]

Size 100 x 80 mm. Coordinates in mm from the lower left corner, seen from the top.
Outline: 0,0 100,0 100,80 0,80 0,0
Copper layers (1*16): Top 0.0356mm / dielectric 1.5011mm / Bottom 0.0356mm
Design rules: minimum track width 6mil, minimum drill 13mil, track to track 6mil, track to pad 6mil, pad to pad 6mil, via to via 6mil, smd to smd 6mil, copper to edge 15mil, drill to drill 6mil, minimum pad ring 7mil, minimum via ring 7mil, stop-mask expansion 4mil, vias tented up to drill 0mil, thermal gap 10mil

### Footprints (pad centres in the part's own frame; a part is rotated, then mirrored left to right if it is on the bottom)
C0603 = smd 1.1 x 1: 1 -0.85,0; 2 0.85,0
PANASONIC_D = smd 3 x 1.4: + 2.4,0; - -2.4,0
VO20 = smd 0.4 x 1.8: 1 5.85,6.15; 2 5.2,6.15; 3 4.55,6.15; 4 3.9,6.15; 5 3.25,6.15; 6 2.6,6.15; 7 1.95,6.15; 8 1.3,6.15; 9 0.65,6.15; 10 0,6.15; 11 0,-0.3; 12 0.65,-0.3; 13 1.3,-0.3; 14 1.95,-0.3; 15 2.6,-0.3; 16 3.25,-0.3; 17 3.9,-0.3; 18 4.55,-0.3; 19 5.2,-0.3; 20 5.85,-0.3
SO-08 = smd 0.6 x 2.2: 1 -1.905,-2.6; 2 -0.635,-2.6; 3 0.635,-2.6; 4 1.905,-2.6; 5 1.905,2.6; 6 0.635,2.6; 7 -0.635,2.6; 8 -1.905,2.6
TQFP32-08 = smd 1.27 x 0.508: 1 -4.293,2.8; 2 -4.293,2; 3 -4.293,1.2; 4 -4.293,0.4; 5 -4.293,-0.4; 6 -4.293,-1.2; 7 -4.293,-2; 8 -4.293,-2.8; 17 4.293,-2.8; 18 4.293,-2; 19 4.293,-1.2; 20 4.293,-0.4; 21 4.293,0.4; 22 4.293,1.2; 23 4.293,2; 24 4.293,2.8 | smd 0.508 x 1.27: 9 -2.8,-4.293; 10 -2,-4.293; 11 -1.2,-4.293; 12 -0.4,-4.293; 13 0.4,-4.293; 14 1.2,-4.293; 15 2,-4.293; 16 2.8,-4.293; 25 2.8,4.293; 26 2,4.293; 27 1.2,4.293; 28 0.4,4.293; 29 -0.4,4.293; 30 -1.2,4.293; 31 -2,4.293; 32 -2.8,4.293
2X10 = drill 1.016 octagon: 1 -11.43,-1.27; 2 -11.43,1.27; 3 -8.89,-1.27; 4 -8.89,1.27; 5 -6.35,-1.27; 6 -6.35,1.27; 7 -3.81,-1.27; 8 -3.81,1.27; 9 -1.27,-1.27; 10 -1.27,1.27; 11 1.27,-1.27; 12 1.27,1.27; 13 3.81,-1.27; 14 3.81,1.27; 15 6.35,-1.27; 16 6.35,1.27; 17 8.89,-1.27; 18 8.89,1.27; 19 11.43,-1.27; 20 11.43,1.27
2X03 = drill 1.016 octagon: 1 -2.54,-1.27; 2 -2.54,1.27; 3 0,-1.27; 4 0,1.27; 5 2.54,-1.27; 6 2.54,1.27
SOT23 = smd 1 x 1.4: 1 -0.95,-1.1; 2 0.95,-1.1; 3 0,1.1
R0805 = smd 1.3 x 1.5: 1 -0.95,0; 2 0.95,0
M0805 = smd 1.3 x 1.6: 1 -0.95,0; 2 0.95,0
SOT223 = smd 1.219 x 2.235: 1 -2.311,-3.099; 2 0,-3.099; 3 2.311,-3.099 | smd 3.6 x 2.2: 4 0,3.099
JP1 = drill 0.914 long: 1 0,-1.27; 2 0,1.27
SOT-23 = smd 0.787 x 0.889: 1 0.025,-1.016; 2 -0.94,1.016; 3 0.991,1.016
TQ144 = smd 1.6 x 0.3: P1 -10.7,8.75; P2 -10.7,8.25; P3 -10.7,7.75; P4 -10.7,7.25; P5 -10.7,6.75; P6 -10.7,6.25; P7 -10.7,5.75; P8 -10.7,5.25; P9 -10.7,4.75; P10 -10.7,4.25; P11 -10.7,3.75; P12 -10.7,3.25; P13 -10.7,2.75; P14 -10.7,2.25; P15 -10.7,1.75; P16 -10.7,1.25; P17 -10.7,0.75; P18 -10.7,0.25; P19 -10.7,-0.25; P20 -10.7,-0.75; P21 -10.7,-1.25; P22 -10.7,-1.75; P23 -10.7,-2.25; P24 -10.7,-2.75; P25 -10.7,-3.25; P26 -10.7,-3.75; P27 -10.7,-4.25; P28 -10.7,-4.75; P29 -10.7,-5.25; P30 -10.7,-5.75; P31 -10.7,-6.25; P32 -10.7,-6.75; P33 -10.7,-7.25; P34 -10.7,-7.75; P35 -10.7,-8.25; P36 -10.7,-8.75; P73 10.7,-8.75; P74 10.7,-8.25; P75 10.7,-7.75; P76 10.7,-7.25; P77 10.7,-6.75; P78 10.7,-6.25; P79 10.7,-5.75; P80 10.7,-5.25; P81 10.7,-4.75; P82 10.7,-4.25; P83 10.7,-3.75; P84 10.7,-3.25; P85 10.7,-2.75; P86 10.7,-2.25; P87 10.7,-1.75; P88 10.7,-1.25; P89 10.7,-0.75; P90 10.7,-0.25; P91 10.7,0.25; P92 10.7,0.75; P93 10.7,1.25; P94 10.7,1.75; P95 10.7,2.25; P96 10.7,2.75; P97 10.7,3.25; P98 10.7,3.75; P99 10.7,4.25; P100 10.7,4.75; P101 10.7,5.25; P102 10.7,5.75; P103 10.7,6.25; P104 10.7,6.75; P105 10.7,7.25; P106 10.7,7.75; P107 10.7,8.25; P108 10.7,8.75 | smd 0.3 x 1.6: P37 -8.75,-10.7; P38 -8.25,-10.7; P39 -7.75,-10.7; P40 -7.25,-10.7; P41 -6.75,-10.7; P42 -6.25,-10.7; P43 -5.75,-10.7; P44 -5.25,-10.7; P45 -4.75,-10.7; P46 -4.25,-10.7; P47 -3.75,-10.7; P48 -3.25,-10.7; P49 -2.75,-10.7; P50 -2.25,-10.7; P51 -1.75,-10.7; P52 -1.25,-10.7; P53 -0.75,-10.7; P54 -0.25,-10.7; P55 0.25,-10.7; P56 0.75,-10.7; P57 1.25,-10.7; P58 1.75,-10.7; P59 2.25,-10.7; P60 2.75,-10.7; P61 3.25,-10.7; P62 3.75,-10.7; P63 4.25,-10.7; P64 4.75,-10.7; P65 5.25,-10.7; P66 5.75,-10.7; P67 6.25,-10.7; P68 6.75,-10.7; P69 7.25,-10.7; P70 7.75,-10.7; P71 8.25,-10.7; P72 8.75,-10.7; P109 8.75,10.7; P110 8.25,10.7; P111 7.75,10.7; P112 7.25,10.7; P113 6.75,10.7; P114 6.25,10.7; P115 5.75,10.7; P116 5.25,10.7; P117 4.75,10.7; P118 4.25,10.7; P119 3.75,10.7; P120 3.25,10.7; P121 2.75,10.7; P122 2.25,10.7; P123 1.75,10.7; P124 1.25,10.7; P125 0.75,10.7; P126 0.25,10.7; P127 -0.25,10.7; P128 -0.75,10.7; P129 -1.25,10.7; P130 -1.75,10.7; P131 -2.25,10.7; P132 -2.75,10.7; P133 -3.25,10.7; P134 -3.75,10.7; P135 -4.25,10.7; P136 -4.75,10.7; P137 -5.25,10.7; P138 -5.75,10.7; P139 -6.25,10.7; P140 -6.75,10.7; P141 -7.25,10.7; P142 -7.75,10.7; P143 -8.25,10.7; P144 -8.75,10.7
TSOP32 = smd 0.5 x 0.2: P1 -9.75,3.75; P2 -9.75,3.25; P3 -9.75,2.75; P4 -9.75,2.25; P5 -9.75,1.75; P6 -9.75,1.25; P7 -9.75,0.75; P8 -9.75,0.25; P9 -9.75,-0.25; P10 -9.75,-0.75; P11 -9.75,-1.25; P12 -9.75,-1.75; P13 -9.75,-2.25; P14 -9.75,-2.75; P15 -9.75,-3.25; P16 -9.75,-3.75; P17 10.25,-3.75; P18 10.25,-3.25; P19 10.25,-2.75; P20 10.25,-2.25; P21 10.25,-1.75; P22 10.25,-1.25; P23 10.25,-0.75; P24 10.25,-0.25; P25 10.25,0.25; P26 10.25,0.75; P27 10.25,1.25; P28 10.25,1.75; P29 10.25,2.25; P30 10.25,2.75; P31 10.25,3.25; P32 10.25,3.75
OSC_7C = smd 1.4 x 1.2: ENA -1.27,-1.1; GND 1.27,-1.1; OUT 1.27,1.1; VDD -1.27,1.1
SO8 = smd 0.6 x 2.2: 1 -1.905,-2.6; 2 -0.635,-2.6; 3 0.635,-2.6; 4 1.905,-2.6; 5 1.905,2.6; 6 0.635,2.6; 7 -0.635,2.6; 8 -1.905,2.6
1503_04 = drill 0.8 pad 1.2 long: 1 3.9,-10.25; 2 0.65,-10.25 | drill 1 pad 1.2 long: 3 -2.3,-10.25 | hole 1.6: 0,0
SCART-F = drill 1.321 long: 1 19.05,5.08; 2 17.145,0; 3 15.24,5.08; 4 13.335,0; 5 11.43,5.08; 6 9.525,0; 7 7.62,5.08; 8 5.715,0; 9 3.81,5.08; 10 1.905,0; 11 0,5.08; 12 -1.905,0; 13 -3.81,5.08; 14 -5.715,0; 15 -7.62,5.08; 16 -9.525,0; 17 -11.43,5.08; 18 -13.335,0; 19 -15.24,5.08; 20 -17.145,0; 21 -19.05,5.08 | hole 3.023: 26.416,0.254; 26.416,-3.302; -26.416,0.254; -26.416,-3.302
M_DIN6 = drill 0.9 pad 1.422 octagon: 1 -1.3,-3.75; 2 1.3,-3.75; 3 -3.4,-3.75; 5 3.4,-3.75; 6 -3.4,-6.2; 8 3.4,-6.25 | drill 2.3 pad 3.5: SH1 6.8,-0.75; SH2 0,0.05; SH3 -6.75,-0.75
F09HP = drill 1.016 octagon: 1 -5.486,-1.27; 2 -2.743,-1.27; 3 0,-1.27; 4 2.743,-1.27; 5 5.486,-1.27; 6 -4.115,1.27; 7 -1.372,1.27; 8 1.372,1.27; 9 4.115,1.27 | drill 3.302 pad 5.08: G1 -12.522,0; G2 12.522,0
85-32004-10X = drill 0.92 pad 1.27: 1 4.71,-1.25; 2 4.71,1.25; 3 2.71,1.25; 4 2.71,-1.25 | drill 2.3 pad 3: M1 0,6.02; M2 0,-6.02
DC-21MM = drill 3.302 pad 4.826 octagon: 1 -5.08,-3.353; 2 -0.076,-6.35; 3 -0.076,-0.356

### Placement (x,y rotation side)
C1  61.5,16.75 0 bottom
C2  93,16 0 top
C3  59.25,12 180 bottom
C4  64,11.5 270 bottom
C5  65,16.75 180 bottom
C6  34.25,44.75 0 bottom
C7  41.25,46.75 270 bottom
C8  41.25,35 90 bottom
C9  27.75,47.25 270 bottom
C10  43,40.5 270 bottom
C11  28.75,40.75 180 bottom
C12  30,46.75 270 bottom
C13  43.5,46.75 270 bottom
C14  30,35.25 90 bottom
C15  33.75,36.75 0 bottom
C16  27.75,34.25 90 bottom
C17  43.5,34.75 90 bottom
C18  39,35.25 90 bottom
C19  32.25,47.5 270 bottom
C20  39,47 270 bottom
C21  32.25,34 90 bottom
C22  34.5,48 270 bottom
C23  36.75,48 270 bottom
C24  34.5,34 90 bottom
C25  36.75,34 90 bottom
C26  84.5,15.25 90 top
C27  87.5,45.5 0 top
C28  88,31.5 0 top
C29  87.5,40.5 0 top
C30  75.5,50.25 270 top
C31  87.5,35.5 0 top
C32  75.5,31.25 90 top
C33  6.25,20.5 180 top
C34  17.75,53.5 180 top
C35  6,22.5 0 bottom
C36  6.5,56 180 top
IC1  75.09,23.24 90 top
IC2  84.9,21.11 0 top
IC3  79.5,59.75 0 top
JP1  28,26 0 top
JP2  28,58 0 top
JP3  72.5,18.25 270 top
Q5  32.75,20.5 0 bottom
Q6  40.75,20.5 0 bottom
Q7  56,20.5 0 bottom
Q8  48.5,20.5 0 bottom
R1  25.01,53.5 180 top
R2  57.42,58 90 top
R3  61.18,55.49 90 bottom
R4  6.5,62.75 180 bottom
R5  2.5,66.25 0 bottom
R6  12.5,62.75 180 bottom
R7  16.5,66.25 180 bottom
R8  33.75,20.75 270 top
R9  39.5,20.75 270 top
R10  41.75,20.75 270 top
R11  95.88,4.25 0 top
R12  97.5,6.5 0 top
R13  30.75,12.5 180 bottom
R14  30.75,14.75 180 bottom
R15  38.25,12.5 180 bottom
R16  38.25,17 180 bottom
R17  97,18.5 0 top
R18  92,20.5 0 top
R19  97.5,13.5 0 top
R20  38.25,14.75 180 bottom
R21  98,10 0 top
R22  92,10.5 0 bottom
R23  59.75,20.75 270 top
R24  46,20.75 270 top
R25  48.25,20.75 270 top
R26  46,12.5 180 bottom
R27  46,14.75 180 bottom
R28  46,17 180 bottom
R29  54.5,20.75 270 top
R30  56.75,20.75 270 top
R31  53.5,12.5 180 bottom
R32  53.5,14.75 180 bottom
R33  53.5,17 180 bottom
R34  62.5,20.75 270 top
R35  93,28.25 0 top
R36  93,25.5 0 top
R37  97.5,32.5 0 top
R38  97.5,29.5 0 top
R39  97.5,27 0 top
R40  96.5,38.5 180 top
R41  96.5,41.5 180 top
R42  96.5,44 180 top
R43  96.5,47 180 top
R44  92,40 180 top
R45  92,43 180 top
R46  97.5,24 0 top
R47  3.25,63 270 bottom
R48  59.5,14.25 0 bottom
R49  65,14.25 0 bottom
R50  51.25,20.75 90 top
R51  10,66.25 270 bottom
R52  82,10.5 270 top
R53  80.5,76.75 0 top
R54  81.5,73.25 0 top
REG1.2  8.5,35.25 270 top
REG2.5  8.5,43 270 top
RESET_SW  84.5,8.5 180 top
T1  6.5,65.75 180 bottom
T2  92.5,7 90 top
T3  12.5,65.75 180 bottom
U1  35.72,41 0 top
U$1  66.75,41.5 270 top
U$2  29.12,22.88 0 top
U$4  8.5,27.5 270 top
U$5  8.5,49.5 270 top
U$6  18.5,41.25 270 top
X1  54,77.25 0 top
X2  45,7.5 180 bottom
X3  10,75.25 0 top
X4  34,68.5 0 top
X5  88,64 270 top
X6  66,70 270 top
X8  4,7.25 180 top

### Tracks (layer width: path | path; a pad name or v marks a point on that pad's centre or on a via)
B0
  Top 0.254: U1.P68 55.47,24.78 57,23.75 57,21.95 R30.1
B1  (1 unrouted)
  Top 0.254: 53.98,22.02 54.5,21.5 | U1.P63 52.98,23.27 54.5,21.75 R29.1
CASIN  (1 unrouted)
CLK16
  Top 0.254: U1.P53 34.97,28.72 44,24.75 30.39,24.75 U$2.OUT
CLK_5V  (1 unrouted)
  Bottom 0.254: 3.5,64.25 3.45,64.3 3.25,64.1 R47.1
  Bottom 0.3: 3.97,66.77 R5.1
  Bottom 0.4: 6.5,66.79 T1.1
  Bottom 0.6: T1.1 3.97,66.77 | R5.1 3.45,64.3 | 6.5,66.79 6.5,69.25
CSYNC
  Top 0.254: U1.P55 35.97,28.72 44.5,24.25 36.3,24.25 R8.1
D_FASTBLANKING  (1 unrouted)
DATA_5V
  Bottom 0.254: R51.1 10.45,67.2 10.5,66.75
  Bottom 0.4: R7.1 15.03,66.77 T3.1 12.51,66.75 10.5,66.75 8.7,68.05 X3.1
FL_DI  (2 unrouted)
FL_DO  (1 unrouted)
FL_HOLD  (1 unrouted)
FL_SCLK  (2 unrouted)
FL_SEL  (1 unrouted)
FL_WP  (1 unrouted)
FPGA_AUDIO_LEFT  (1 unrouted)
  Top 0.254: 59.5,21.75 59.5,22.75 55.98,25.27 U1.P69
FPGA_AUDIO_RIGHT
  Top 0.254: R34.1 62.45,23.25 60,23.25 56.48,25.77 U1.P70
G0
  Top 0.254: U1.P60 51.47,25.22 50,23.75 48.5,23.75 48.5,21.95 R25.1
G1
  Top 0.254: 46,21.5 R24.1 46,22.75 48,24.75 50,24.75 50.97,25.72 U1.P59
GND  (via drill 0.6)  (30 unrouted)
  Top 0.2: U1.P37 U1.P38 U1.P39
  Top 0.254: 31.5,7.5 X2.18 | U$1.P30 69.5,30.75 69.25,30.5 | 69.25,30.5 69,30.25 66.5,30.25 | 62.25,10.5 67.5,10.5 67.5,10.75 | 62.25,10.5 62,10.5 | 26,14 26,2.5 | 26,14 26,16.75 28,16.75 28.39,17.14 28.39,19.39 29,20 30,20 30.5,20.5 30.5,21.67 U$2.GND | 66.5,30.25 62,30.25 v61.5,30.75 | v62.25,12.25 62.25,10.5 | v70,30.25 69.5,30.25 69.25,30.5 | 18.75,14 26,14 | 67.5,10.75 v67,11.25 | 67.5,10.75 67.5,13.25 76.5,13.25 v76.5,15.25 | IC1.11 73.76,23.24 v73.75,23 | 66.5,30.25 U$1.P24 | 19,14.25 18.75,14 | 18.75,14 18.5,13.75 v16.5,13.75 | U1.P9 v26.5,45.75 | U1.P29 v26.5,35.75 | U1.P22 v28.5,39.25 | U1.P45 30.97,31.72 v30.75,31.75 | U1.P39 27.97,31.72 v28,31.75 v29,31.75 29.47,31.28 U1.P42 | U1.P16 v28.5,42.25 | v29,50.25 29.5,50.75 29.5,51.75 | U1.P136 30.97,50.78 v30.75,50.25 | U1.P81 v44.75,36.25 | U1.P88 v44.75,39.75 | U1.P101 v44.75,46.25 | U1.P94 v44.75,42.75 | 42,30.32 42,31.75 42.5,31.75 v43,32.25 | U1.P64 40.5,30.33 v40.5,32.25 40,32.75 40,36.75 v40.5,37.25 | U1.P117 40.47,50.28 v40.5,50.25 | v42.25,50.25 42,50.25 42,51.75 | C32.2 v75.5,33.5 | C30.2 v75.5,48 | 17.85,31.6 v18,31.75 | U$6.P24 18.25,30.5 17.75,30 | v12.5,31.25 13.75,30 17.75,30 | U$6.P30 21.25,30.25 21,30 17.75,30 | C34.2 15.75,53.5 v15.5,53.25
  Top 0.4: X2.21 26.42,2.42 | 39.28,5.21 39.5,5
  Top 0.406: 41.19,4.81 41,5 | 48.81,4.81 49,5 | 33.57,4.93 33.5,4.93 | 33.57,4.86 33.5,4.93 | 56.43,4.93 56.5,5 | 33.5,4.93 33,4.93 33,5
  Top 0.6: 26.42,2.42 29,5 31.5,5 | 31.5,5 33,5 39.5,5 41,5 49,5 56.5,5 57.5,5 57.5,6.5 58.5,7.5 58.5,8.5 60.5,10.5 62,10.5 | X2.13 41.19,4.81 | X2.9 48.81,4.81 | X2.17 33.57,4.86 | X2.5 56.43,4.93 | X2.14 39.28,5.21 | 31.5,5 31.5,7.5 | 5,29.75 5.4,29.75 U$4.1 | X8.3 6.11,7.61 9,10.5 | C33.- 8.65,11.03 X8.1 | C36.- v12,56
  Top 0.61: U$4.1 3.56,29.81 v3.5,29.75 | REG2.5.1 3.56,45.31 v3.5,45.25 | REG1.2.1 3.69,37.56 v3.5,37.75 | U$5.1 4,51.41 v4,51.5
  Bottom 0.254: C5.1 C1.1 62.25,16.75 v62.25,12.25 | 15.5,22.5 15.5,20.75 15.5,13.75 | 15.5,13.75 15.5,4 23,4 24,3 25.37,3 X2.21 | v73.75,23 73.75,23.25 76.5,23.25 | v67,11.25 69,11.25 | 76.5,23.25 v76.5,15.25 76.04,15.71 JP3.6 | 61.25,31 45.75,31 45,31.75 43.5,31.75 | 61.25,31 v61.5,30.75 | 76.5,30.25 77.5,30.75 | v70,30.25 75.5,30.25 | 75.5,30.25 76.5,30.25 | 76.5,30.25 76.5,23.25 | v16.5,13.75 15.5,13.75 | 29,49.5 v29,50.25 29.5,50.25 | 28,45.75 v26.5,45.75 23.5,45.75 23,46.25 23,50.75 23.25,51 | v28,31.75 26.75,32 | v29,31.75 v30.75,31.75 | v26.5,35.75 27.15,35.1 C16.2 28,36.25 30.15,36.25 | C9.2 28,45.75 | v44.75,36.25 43.65,36.25 C17.2 43.25,36 41,36 C8.2 40.9,35.75 40.55,36.1 40.5,36.1 | v44.75,39.75 44.65,39.65 C10.2 | 44.25,45.5 44.25,43.25 v44.75,42.75 61.5,42.75 62,42.25 | 44.25,45.5 44.25,45.75 v44.75,46.25 61.5,46.25 62,45.75 | v43,32.25 43.5,31.75 | v40.5,32.25 40.5,31.75 43.5,31.75 | C21.2 C24.2 C25.2 36.75,35.5 37,35.75 38.65,35.75 C18.2 40.5,36.1 | v44.75,36.25 v44.75,39.75 | v40.5,37.25 40.5,36.1 | C15.2 32.9,35.5 C21.2 | C21.2 32.25,35 31,36.25 30.15,36.25 | 30.15,36.25 C14.2 | 31,49.25 v30.75,50.25 29.5,50.25 | 39,46.25 37.75,46.25 37.1,47.15 C23.2 C22.2 34,46.65 33.5,46.65 | 39,46.25 39.15,46.25 C20.2 | 33.5,46.65 C19.2 31.5,45.9 C12.2 29.85,45.75 28,45.75 | v40.5,50.25 41.5,50.25 | 41.5,50.25 v42.25,50.25 | 39,46.25 39.35,45.9 C7.2 C13.2 43.85,45.9 44.25,45.5 | 33.5,46.65 33.4,46.55 C6.2 33.4,42.65 31.5,40.75 C11.2 | 23.25,51 26,53.75 30,53.75 | 30,53.75 29.5,53.25 29.5,50.25 | 30,53.75 42.5,53.75 | 42.5,53.75 42,53.25 42,50.75 41.5,50.25 | 42.5,53.75 45,53.75 62,50.75 62,45.75 | 62,45.75 62,42.25 | 62,42.25 62,39.25
  Bottom 0.254: 62,39.25 61.5,39.75 v44.75,39.75 | 62,39.25 62,35.75 | 62,35.75 61.5,36.25 v44.75,36.25 | 62,35.75 62,31.75 61.25,31 | v28.5,42.25 29,42.25 29.6,41.65 C11.2 | C11.2 29.6,39.35 29.5,39.25 v28.5,39.25 | 75.5,30.25 v75.5,33.5 v75.5,48 | v12.5,31.25 12.5,30.25 | v15.5,53.25 15.5,52.75 16,52.25 22.5,52.25 23.25,51 | 1,38.75 1,39.25
  Bottom 0.6: 15,31.75 15,21.25 12.75,21.25 12,20.5 | 1,55.25 1,54 12,54 v12,56 | 1,51.5 1,41 | 1,41 1,30.75 | X3.3 6.6,73.85 | 6.6,73.85 8,75.25 16.05,75.25 X3.SH1 | 1,25.59 1,25.75 | 26.75,32 26.75,30.25 12.5,30.25 | 6.6,73.85 4.15,73.85 3.5,74.5 | 1,38 1,7.5 4.08,7.5 | 12,20.5 12,14.5 11,13.5 11,12.52 X8.1 | C35.- 12,22.5 12,20.5 | 1,41 22.5,41
  Bottom 0.61: v3.5,29.75 1,29.75 | 1,29.75 1,30.75 1,37.75 | 1,45.25 1,51.5 | 1,51.5 1,54 1,54.25 | 1,29.75 1,25.75 | 1,45.25 1,41 1,38.75 1,38 1,37.75 | 15,31.75 v18,31.75 | 15,21.25 15.5,20.75 | v3.5,45.25 1,45.25 | v3.5,37.75 1,37.75 | v4,51.5 1,51.5
  Bottom 0.813: 4.08,7.5 X8.3
  other vias: 70.5,53.25
N$1
  Top 0.254: U1.P108 62,49.75 63,50.75 U$1.P16
N$2
  Top 0.254: U$1.P15 63.5,50.25 62.5,49.25 U1.P107
N$3
  Top 0.254: U$1.P14 64,49.25 63,48.25 U1.P105
N$4
  Top 0.254: U1.P104 63.5,47.75 64.5,48.75 U$1.P13
N$5
  Top 0.254: U1.P103 64,47.25 65,48.25 U$1.P12
N$6
  Top 0.254: U$1.P11 65.5,47.75 64.5,46.75 U1.P102
N$7
  Top 0.254: U1.P100 64.5,45.75 66,47.25 U$1.P10
N$8
  Top 0.254: U1.P99 65.5,45.25 66.5,46.25 U$1.P9
N$9
  Top 0.254: U$1.P7 67.5,45.75 66.5,44.75 U1.P98
N$10
  Top 0.254: U1.P97 67,44.25 68,45.25 U$1.P6
N$11
  Top 0.254: U$1.P5 68.5,44.75 67.5,43.75 U1.P96
N$12
  Top 0.254: U$1.P4 69,44.25 68,43.25 U1.P95
N$13
  Top 0.254: U$1.P3 69.5,43.75 68,42.25 U1.P93
N$14
  Top 0.254: U$1.P2 70,43.25 68.5,41.75 U1.P92
N$15
  Top 0.254: U$1.P1 70.5,42.75 68.5,40.75 U1.P90
N$16
  Top 0.254: U1.P73 62,32.25 U$1.P17
N$17
  Top 0.254: U1.P74 62.5,32.75 63.5,31.75 U$1.P18
N$18
  Top 0.254: U1.P76 62.5,33.75 64,32.25 U$1.P19
N$19
  Top 0.254: U$1.P20 64.5,32.75 63,34.25 U1.P77
N$20
  Top 0.254: U1.P78 63.5,34.75 65,33.25 U$1.P21
N$21
  Top 0.254: U$1.P22 65.5,33.75 64,35.25 U1.P79
N$22
  Top 0.254: U1.P80 64.5,35.75 66,34.25 U$1.P23
N$23
  Top 0.254: U$1.P25 67,34.25 64.5,36.75 U1.P82
N$24
  Top 0.254: U1.P83 65,37.25 67.5,34.75 U$1.P26
N$25
  Top 0.254: U$1.P27 68,35.25 65.5,37.75 U1.P84
N$26
  Top 0.254: U1.P85 66,38.25 68.5,35.75 U$1.P28
N$27
  Top 0.254: U$1.P29 69,36.25 66.5,38.75 U1.P86
N$28
  Top 0.254: U$1.P31 70,36.25 67,39.25 U1.P87
N$29  (1 unrouted)
  Top 0.254: U$1.P32 70.5,36.75 67,40.25 46.5,40.25
N$30  (1 unrouted)
  Top 0.2: 91.05,28.13 R35.1
N$31  (1 unrouted)
  Top 0.2: 91.55,25.39 R36.1
N$32  (1 unrouted)
N$33  (1 unrouted)
N$34  (1 unrouted)
  Top 0.2: 96.55,26.88 R39.1
N$35  (1 unrouted)
  Top 0.254: IC1.3 57.5,27.79 44.5,30.5
N$36  (1 unrouted)
N$37  (1 unrouted)
N$38
  Top 0.254: IC1.10 66.01,23.24 66,23.25 66,23.75 60.5,23.75 57,26.25 44,30.27 U1.P71
N$39  (1 unrouted)
N$40  (1 unrouted)
  Top 0.254: IC1.7 72.44,25.19 73,25.75 73,36.75
N$41  (1 unrouted)
  Top 0.2: 95.54,38.51 R40.2
N$42
  Top 0.254: R1.1 26.25,52.42 U1.P144
N$43  (1 unrouted)
N$44  (1 unrouted)
  Top 0.2: 95.31,41.26 R41.2
N$45  (2 unrouted)
  Top 0.2: 95,44.5 95.5,44
N$46  (2 unrouted)
  Top 0.2: 95.24,46.74 95.5,47
N$47  (2 unrouted)
  Top 0.2: 90.89,39.88 91,40
N$48  (1 unrouted)
N$49  (1 unrouted)
N$50
  Top 0.254: REG2.5.2 5.65,43.25
N$51  (via drill 0.6)
  Top 0.254: R23.2 59.75,18.75 v59.5,18.5
  Bottom 0.254: v59.5,18.5 60.65,17.85 C1.2 60.65,14.45 R48.1
N$52
  Bottom 0.254: R48.2 58.55,12.15 C3.1
N$53  (via drill 0.6)
  Top 0.254: v41.75,17.75 R10.2 41.7,19.8 41.5,20 39.7,20 R9.2
  Bottom 0.254: v41.75,17.75 41.75,19.35 Q6.1
N$54
  Bottom 0.6: R15.2 R20.2 R16.2 39.8,17 Q6.2
N$55  (via drill 0.6)
  Top 0.254: R24.2 R25.2 48.25,18.5 v49.25,17.5
  Bottom 0.254: v49.25,17.5 49.25,19.2 Q8.1
N$56
  Bottom 0.6: R26.2 R27.2 R28.2 47.55,17 Q8.2
N$57  (via drill 0.6)  (1 unrouted)
  Top 0.254: R29.2 R30.2 | v57,17.5 57,19.5
  Bottom 0.254: Q7.1 56.95,17.55 v57,17.5
N$58
  Bottom 0.6: R31.2 R32.2 R33.2 55.05,17 Q7.2
N$59
  Bottom 0.6: R13.2 R14.2 31.8,14.75 Q5.2
N$60  (3 unrouted)
N$61  (2 unrouted)
N$62  (1 unrouted)
N$63  (via drill 0.6)
  Top 0.254: R8.2 v33.75,17.75
  Bottom 0.254: v33.75,17.75 33.75,19.35 Q5.1
N$64
  Bottom 0.254: C4.1 64,14.2 R49.2
N$65  (via drill 0.6)
  Top 0.254: v65.75,19.75 R34.2
  Bottom 0.254: v65.75,19.75 65.85,18.15 C5.2 65.95,16.65 R49.1
N$66  (1 unrouted)
N$67
  Top 0.254: U$6.P1 22.25,50 22.5,49.75 U1.P1
N$68  (1 unrouted)
N$69  (1 unrouted)
N$71
  Top 0.254: U$6.P2 21.75,49.5 22,49.25 U1.P2
N$72
  Top 0.254: U$6.P3 21.25,49 22,48.25 U1.P4
N$73
  Top 0.254: U$6.P4 20.75,48.5 21.5,47.75 U1.P5
N$74
  Top 0.254: U$6.P5 20.25,48 21,47.25 U1.P6
N$75
  Top 0.254: U$6.P6 19.75,47.5 20.5,46.75 U1.P7
N$76
  Top 0.254: U$6.P7 19.25,47 20,46.25 U1.P8
N$77
  Top 0.254: U$6.P9 18.25,46 19,45.25 U1.P10
N$78
  Top 0.254: U$6.P10 17.75,45.5 18.5,44.75 U1.P11
N$79
  Top 0.254: U$6.P11 17.25,45 18,44.25 U1.P12
N$80
  Top 0.254: U$6.P12 16.75,44.5 17.5,43.75 U1.P13
N$81
  Top 0.254: U$6.P13 16.25,44 17,43.25 U1.P14
N$82
  Top 0.254: U$6.P14 15.75,43.5 16.5,42.75 U1.P15
N$83
  Top 0.254: U$6.P15 15.25,42.5 16,41.75 U1.P17
N$84
  Top 0.254: U$6.P16 14.75,42 15.5,41.25 U1.P18
N$85
  Top 0.254: U$6.P17 14.75,38.5 16.5,40.25 U1.P20
N$86
  Top 0.254: U$6.P18 15.25,38 17,39.75 U1.P21
N$87
  Top 0.254: U$6.P19 15.75,37 17.5,38.75 U1.P23
N$88
  Top 0.254: U$6.P20 16.25,36.5 18,38.25 U1.P24
N$89
  Top 0.254: U$6.P21 16.75,36 18.5,37.75 U1.P25
N$90
  Top 0.254: U$6.P22 17.25,35.5 19,37.25 U1.P26
N$91
  Top 0.254: U$6.P23 17.75,35 19.5,36.75 U1.P27
N$92
  Top 0.254: U$6.P25 18.75,34.5 20.5,36.25 U1.P28
N$93
  Top 0.254: U$6.P26 19.25,34 20.5,35.25 U1.P30
N$94
  Top 0.254: U$6.P27 19.75,33.5 21,34.75 U1.P31
N$95
  Top 0.254: U$6.P28 20.25,33 21.5,34.25 U1.P32
N$96  (1 unrouted)
  Top 0.254: U$6.P29 20.75,32.5 22,33.75 25,33.75
N$97
  Top 0.254: U$6.P31 21.75,32.5 22,32.75 U1.P35
N$98
  Top 0.254: U$6.P32 22.25,32 22.5,32.25 U1.P36
PROM_DO  (via drill 0.6)
  Top 0.254: 69,29.09 IC1.1 66.66,29.09 v66.5,29 | v54,27 41,30.27 U1.P65
  Bottom 0.254: v54,27 66.25,27 66.5,27.25 v66.5,29
PROM_INITB  (via drill 0.6)
  Top 0.254: v49.75,26 50.48,26.73 U1.P58 | v65.5,26 65.5,24.5 68.91,24.5 IC1.8
  Bottom 0.254: v49.75,26 v65.5,26
PS2CLK  (via drill 0.6)  (1 unrouted)
  Top 0.254: 11,59.5 9.5,61 v5.5,61
  Bottom 0.254: R47.2 4.85,62.05 R4.1 5.5,62.7 v5.5,61
  Bottom 0.4: T1.2 R4.1
PS2DAT  (via drill 0.6)  (2 unrouted)
  Bottom 0.254: 10.57,64.73 R51.2 10,65 10.27,64.73 T3.2 | v11.5,61 11.5,62.5
  Bottom 0.4: R6.1 T3.2
R0
  Top 0.254: U1.P57 49.97,27.72 45.5,23.25 42.5,23.25 42,22.75 42,21.95 R10.1
R1
  Top 0.254: U1.P56 49.47,28.22 45,23.75 40.5,23.75 39.5,22.75 R9.1
RESET  (4 unrouted)
  Top 0.254: 43.75,25.5 34.5,29.25 34.5,30.27 U1.P52
SCART_BLANKING
  Top 0.254: R50.1 51.25,14.25 51,14 36,14 35.5,13.5 35.5,7.53 X2.16
SCART_BLUE  (1 unrouted)
  Bottom 0.6: R33.1 R32.1 R31.1 52.5,12.5 52.5,2.54
SCART_COMP
  Bottom 0.6: R14.1 R13.1 | X2.19 29.76,12.5 R13.1 | 30,12.5 R13.1
SCART_GREEN
  Bottom 0.6: R28.1 R27.1 R26.1 45,12.5 X2.11
SCART_LEFT
  Bottom 0.2: 60.24,11.66 C3.2
  Bottom 0.4: X2.3 60.24,11.66
SCART_RED
  Bottom 0.6: R16.1 R20.1 R15.1 37.38,12.5 X2.15
SCART_RIGHT
  Bottom 0.254: 64.05,10.35 64,10.35 C4.2
  Bottom 0.4: X2.1 64.05,10.35
TCK  (via drill 0.6)  (2 unrouted)
  Top 0.254: 72.5,37.75 72.5,26 72.34,25.84 72.25,25.84 | 71.84,25.84 72,26 | 72,26 v72,26.5 | IC1.6 72.25,25.84 | 72,26 72.09,26 72.25,25.84
  Bottom 0.254: v72,26.5 72,26 71.75,25.75 67.5,25.75 67.25,25.5 67.25,21.75 68.5,21.75 69,21.25 69,20.48 JP3.3
TDI_FPGA  (1 unrouted)
TDO_EXP  (via drill 0.6)  (1 unrouted)
  Top 0.254: v71,23.75 72,24.75 73,24.75 73.5,25.25 73.5,36.75
  Bottom 0.254: JP3.1 71.23,23.52 v71,23.75
TDO_FPGA  (1 unrouted)
  Top 0.254: 71.5,36.75 71.5,28.75 70.5,28.75 70.5,27.25 70.39,27.14 IC1.4
TDO_PROM  (via drill 0.6)  (2 unrouted)
  Top 0.254: IC1.17 74.11,27.14 74,27.25 | 74,27.25 74,24.75 73,23.75 v72.5,23.75 | 74,27.25 74,36.75
  Bottom 0.254: v72.5,23.75 72.5,22.25 74,20.75
TMS  (via drill 0.6)  (2 unrouted)
  Top 0.254: 72,36.75 72,28.25 71,28.25 | IC1.5 70.74,26.49 71,26.75 71,28.25 | 71,28.25 v71.5,27.75
  Bottom 0.254: v71.5,27.75 71,27.25 71,26.75 70.75,26.5 66.75,26.5 66.5,26.25 66.5,21.25 69,18.75 69,16.25 69.5,15.75 71.19,15.75 JP3.5
VCC  (via drill 0.6)  (21 unrouted)
  Top 0.2: R46.2 98.45,25.5 | 98.45,25.5 R39.2 98.45,28.25 | 98.45,28.25 R38.2 R37.2 | R35.2 98.45,28.25 | R36.2 98.45,25.5 | R40.1 97.45,40 | 97.45,40 R41.1 97.45,42.62 | 97.45,42.62 R42.1 R43.1 | R44.1 97.45,40 | R45.1 93.38,43 93.62,42.75 97.33,42.75 97.45,42.62
  Top 0.254: v55,23.5 55,27.5 54.5,28 41.5,30.27 U1.P66 41.5,30.33 41.5,32.75 v41.75,32.75 42.25,33.25 v44.75,33.25 U1.P75 | 75.5,22 76.25,22 77,22.75 77,27.75 76.96,27.79 IC1.18 IC1.19 IC1.20 75.39,29.14 75.5,29.25 C32.1 | 75.5,22 65.5,22 v65,22.5 | JP3.4 75.5,18.25 75.5,22 | U1.P19 v26.5,40.75 27,40.25 31,40.25 31.5,40.75 32,40.75 | U1.P3 v26.5,48.75 | U1.P138 29.97,49.53 v30,49 29.75,48.75 v26.5,48.75 | U1.P91 v44.75,41.25 | U1.P126 35.97,46.22 v36.5,45.75 | 26.75,49 v26.5,48.75 | v35,42.25 33.5,40.75 v34.5,39.75 | U1.P54 35.47,35.72 v36,36.25 | U1.P106 44.5,48.75 | C30.1 75.5,52.25 67,52.25 | 67,52.25 61,52.25 | U$1.P8 67,52.25 | U1.P43 29.97,32.75 29.97,32.97 v30.25,33 | U1.P34 26.5,33.25 v26.5,33.75 | v40.75,49 41.5,48.75 41.47,48.78 U1.P115 | U$6.P8 18.75,52 18.5,52.25 18.6,52.35 C34.1
  Top 0.6: 32,40.75 29,43.75 29,47.25 27,47.25 27,48.25 v26.5,48.75 26.5,50.25 24.5,52.25 18.5,52.25 | 32,40.75 32,39.25 29,36.25 29,32.75 | 32,40.75 33.5,40.75 v38.5,40.75 | v40.75,49 41.25,49 41.25,43 40.5,42.25 v40.5,40.75 40.5,39.5 41.5,38.5 | 41.5,38.75 41.5,38.5 | 41.5,38.5 41.5,33 v41.75,32.75 | v44.75,48.25 44.75,48.75 | 44.75,48.75 44.75,50 61,52.25 | 44.75,48.75 44.5,48.75 41.5,48.75 | 29,32.75 27,32.75 27,32.25 24,29.25 23.5,29.25 | 29,32.75 29.97,32.75 | v15.5,63.5 15.5,62.5 9,62.5 v9,63.5
  Top 0.61: U$5.3 U$5.2 | U$5.6 U$5.7
  Bottom 0.2: 7.45,62.3 7.05,62.3 7,62.25
  Bottom 0.254: 40.5,21.5 40.6,21.6 Q6.3 Q8.3 | Q7.3 56,22.5 | v55,23.5 56,22.5 | v65,22.5 56,22.5 | v26.5,48.75 28,48.75 27.75,48.5 C9.1 | 44.6,48.4 v44.75,48.25 | v44.75,33.25 43.5,33.25 43,33.75 | v41.75,32.75 41,33.25 41,33.9 C8.1 41.5,33.9 C17.1 | v36,36.25 35.5,36.75 C15.1 34.6,39.65 v34.5,39.75 | v30,49 30,47.75 | 30,47.75 28.1,47.75 28.1,48.65 | v40.75,49 41.25,48 41.5,47.75 41.35,47.6 C7.1 C13.1 | v36.5,45.75 36,45.75 35,44.75 | v35,42.25 35,44.75 | v40.5,40.75 40.5,41.25 43,41.25 | 43,41.25 43.5,41.25 | 43.5,41.25 v44.75,41.25 | 43.4,41.35 43.5,41.25 | v30.25,33 C14.1 30,34.25 29,33.25 27.9,33.25 C16.1 27.6,33.25 27,33.25 v26.5,33.75 | C11.1 v26.5,40.75 | C10.1 43,41.25 | 35,44.75 C6.1 | C12.1 30,47.75 | 32.6,21.75 Q5.3
  Bottom 0.4: T3.3 13.49,62.79 R6.2 | R4.2 7.45,62.3 7.5,62.25
  Bottom 0.6: Q5.3 40.5,21.6 40.5,21.5 | Q7.3 Q8.3 | v38.5,40.75 v40.5,40.75 | R6.2 15.5,62.75 v15.5,63.5 | 7.5,62.25 9,62.25 v9,63.5 | T1.3 7.45,64.73 R4.2
  other vias: 24,19
VCC5  (via drill 0.6)  (1 unrouted)
  Top 0.6: v17.5,64.75 v1.5,64.75 0.75,64.5 | 2,29.15 2,29.25 | 2,40.75 2,47.5 2,56 | 0.5,64 0.5,60 2,58.5 2,56 | 3.85,21.15 2,23 2,25.5 | U$5.4 2,47.59 | C36.+ 2,56
  Top 0.61: U$4.3 2.06,25.19 | 2.06,25.19 2,25.25 | 2,25.25 2,25.5 2,29.25 2,33.25 | 2.06,25.19 2,25.13 2,25.25 | REG2.5.3 2.06,40.69 2,40.75 2,33.25 | REG1.2.3 2.31,32.94 2,33.25 | 2,47.59 2,47.5
  Top 0.813: X8.2 4.08,20.27 C33.+ 3.85,21.15 | 0.5,64 1,64.5
  Bottom 0.4: 17.5,66.3 R7.2 17.5,66.25 | 1.55,64.8 v1.5,64.75
  Bottom 0.6: v17.5,64.75 17.5,66.25 | R5.2 1.55,64.8 | 17.5,66.3 17.5,67.4 X3.5 | 4.08,22.5 X8.2
  Bottom 0.813: C35.+ 4.08,22.5
VCCAUX  (via drill 0.6)
  Top 0.254: 32.5,31.75 v32,31.75 | 39.5,32.75 39.5,30.33 U1.P62 52.48,23.98 51,22.5 51,22 | 39.5,32.75 39.5,38.75 33.5,38.75 32.5,37.75 32.5,31.75 | U1.P48 32.5,30.33 32.5,31.75 | v38.5,33 39,32.75 39.5,32.75 | U1.P134 31.97,50.25 | 31.97,50.25 31.97,50.03 v32,49.75 | U1.P120 38.97,50.22 | 38.97,50.22 39.5,49.75 39.5,43.25 | 31.97,50.25 32.47,49.75 32.5,49.75 32.5,43.25 | 38.97,50.22 38.97,49.28 v39,49.25 | 51,21.5 51,22 | R50.2 51.25,21.75 51,22
  Top 0.6: 39.5,38.75 39.5,43.25 32.5,43.25 32,43.75 v31.5,43.75 | 11,42.25 11.5,42.75 12,42.75 12,42.5 11.6,42.5 REG2.5.4 12.1,43.5 v13.5,43.5
  Bottom 0.254: C21.1 32,32.65 v32,31.75 | C18.1 38.5,33.9 v38.5,33 | C19.1 32,49.1 v32,49.75 | 39,47.75 C20.1 v39,49.25
  Bottom 0.6: v31.5,43.75 26.5,43.75 26.5,42.25 13.5,42.25 v13.5,43.5
VCCINT  (via drill 0.6)  (1 unrouted)
  Top 0.254: U1.P61 39,30.33 39,31.75 v38.5,31.75 38,31.75 37,32.75 37,37.25 33,37.25 33,31.75 | U1.P49 33,30.33 33,31.75 | 33,31.75 v33.75,31.75 | U1.P133 32.47,50.78 33,50.25 v34,50.25 | 38,50.25 38.5,50.75 38.5,51.75
  Top 0.6: v37,50.25 38,50.25 38,45.25 v37,44.25 | 37,37.25 v37,37.75 | REG1.2.4 11,35.85 11,36 11.25,35.75 v13.5,35.75
  Bottom 0.254: v38.5,31.75 38,31.75 | v33.75,31.75 34.5,31.75 | 38,31.75 37.25,32.5 C25.1 | 34.5,31.75 38,31.75 | 34.5,31.75 35,32.25 C24.1 | 36.75,50 v37,50.25
  Bottom 0.6: v37,50.25 v34,50.25 34.5,49.75 C22.1 | C23.1 36.75,50 | v37,37.75 37,40.75 | 37,40.75 v37,44.25 | 37,40.75 33.5,40.75 31,38.25 26.5,38.25 26.5,39.25 13.5,39.25 v13.5,35.75